# Altium project AMA4B_adapter_board.PrjPcb (part 1 of 2)
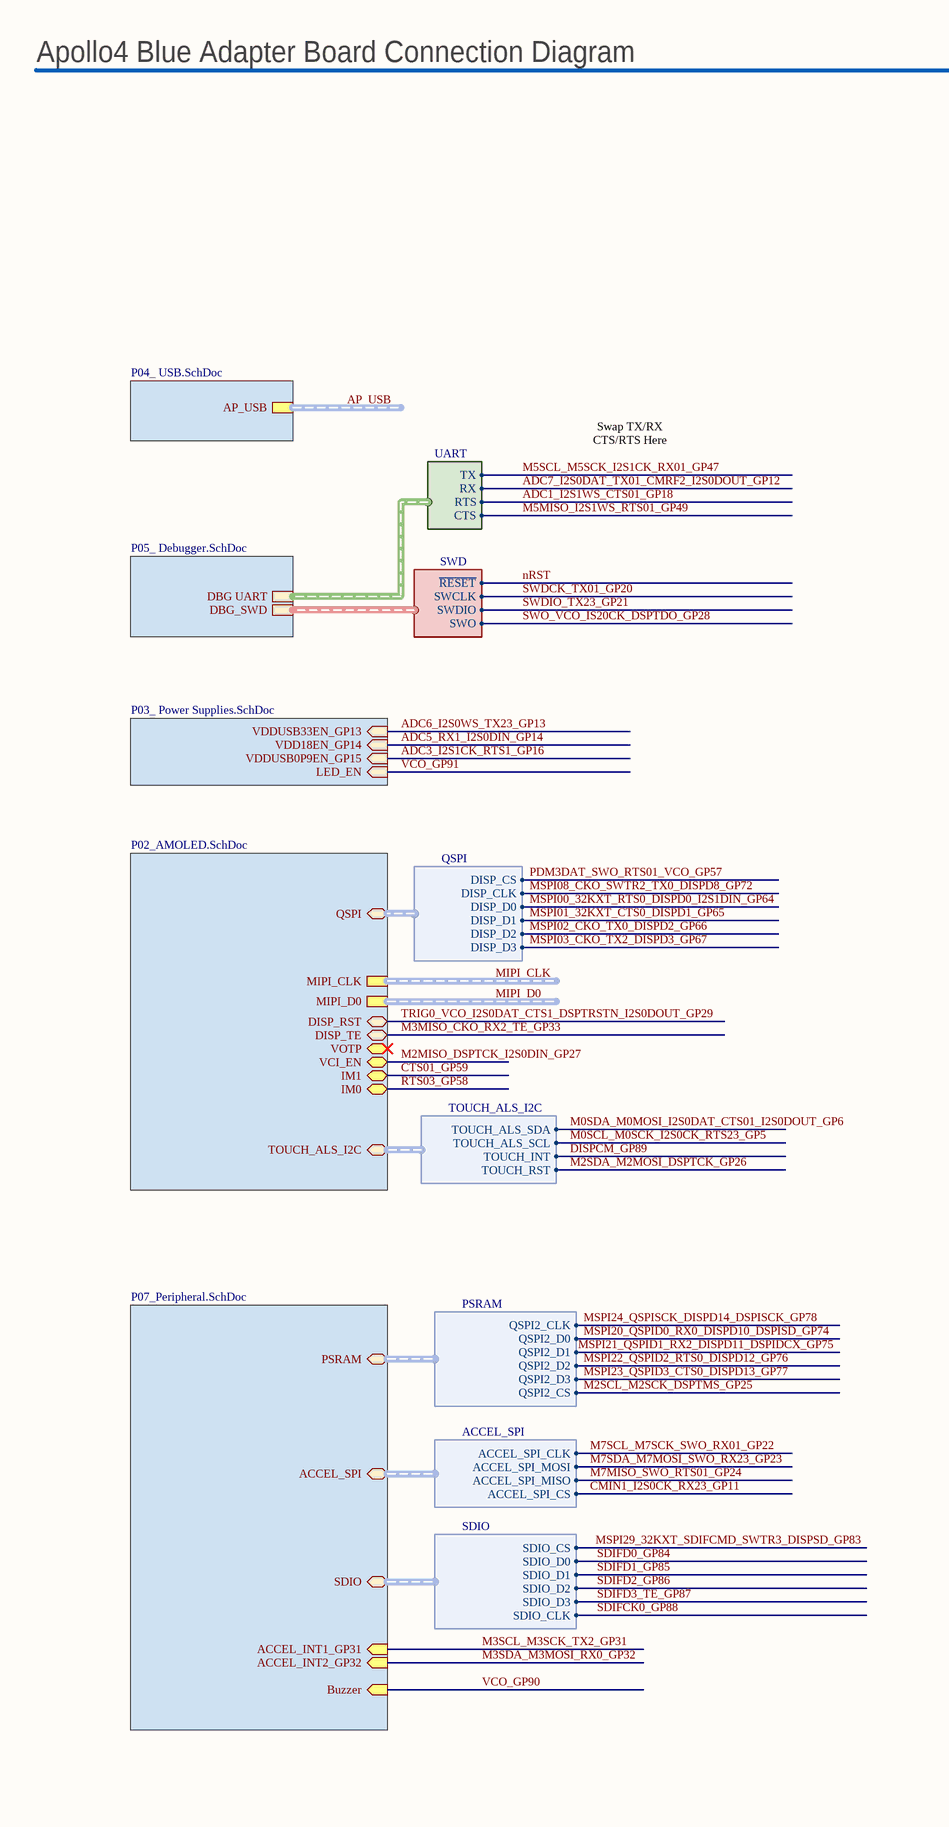
[diagram p0: P01_Top Level.SchDoc, left]
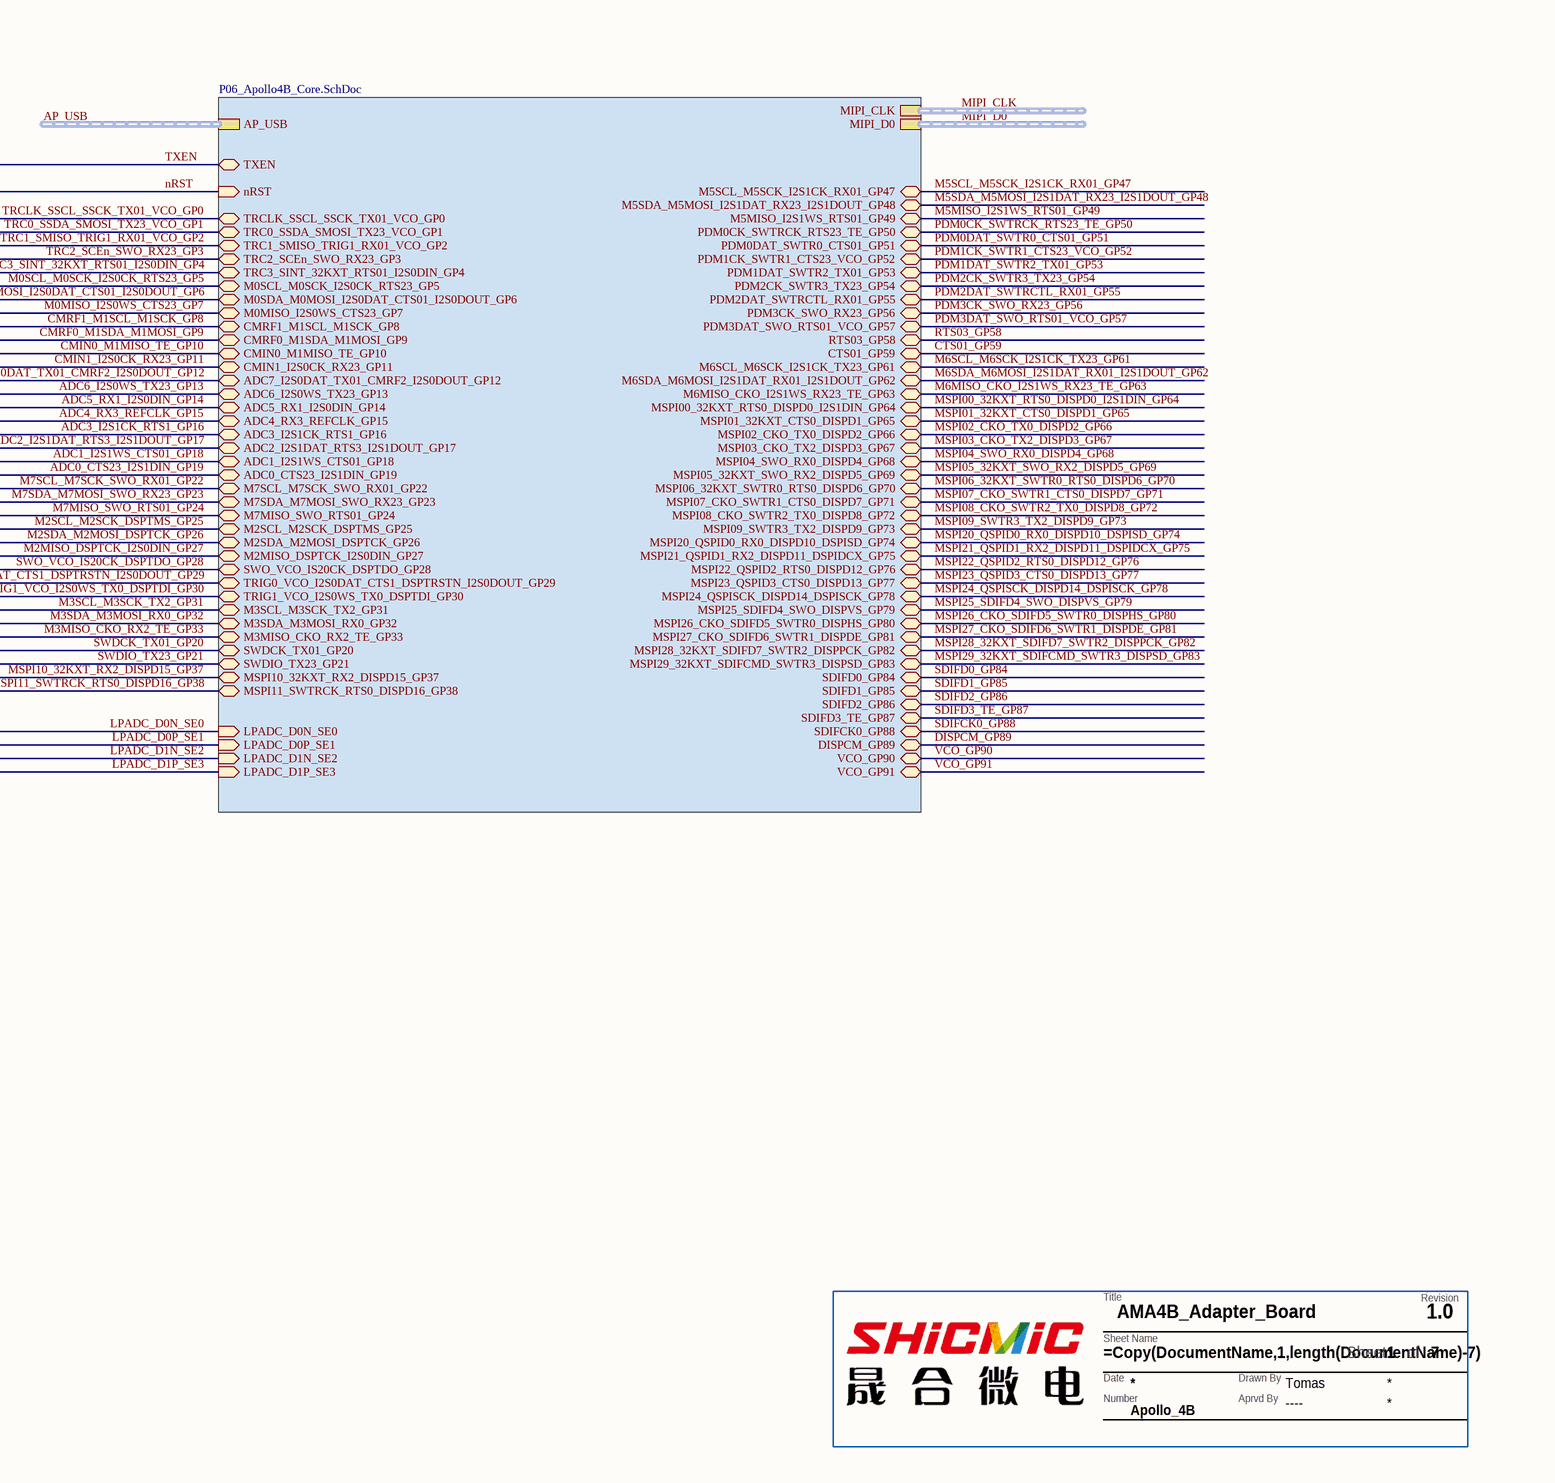
[diagram p1: P01_Top Level.SchDoc, right]
SheetTotal: 7; TBApprovedBy: ----; TBBoardNumber: Apollo_4B; TBDocumentNumber: Apollo_4B; TBDrawnBy: Tomas; TBRevision: 1.0; TBTitle: AMA4B_Adapter_Board
7 sheets, 91 parts. Net scope: hierarchical (ports join the sheet entries above them; power ports are global).
Board file: AMA4B_adapter_board.PcbDoc
Sheets:
  P01_Top Level.SchDoc
    U_P06_ Apollo4B_core = P06_Apollo4B_Core.SchDoc
    U_P03_ Power Supplies = P03_ Power Supplies.SchDoc
    U_P04_ USB = P04_ USB.SchDoc
    U_P05_ Debugger = P05_ Debugger.SchDoc
    U_P02_ AMOLED = P02_AMOLED.SchDoc
    P07_Peripheral = P07_Peripheral.SchDoc

## Sheet P01_Top Level.SchDoc
size C; SheetNumber: 1; SheetTotal: 7

### Parts
(Parts that share a designator on the sheet are numbered #1, #2 ... from top to bottom, then left to right.)
?#1  TitleBlock  (value not drawn)  (graphical)

### Sub-sheets
P07_Peripheral = P07_Peripheral.SchDoc: PSRAM (bidir, harness PSRAM), ACCEL_SPI (bidir, harness ACCEL_SPI), SDIO (bidir, harness SDIO), Buzzer (in), ACCEL_INT1_GP31 (in), ACCEL_INT2_GP32 (in)
U_P02_ AMOLED = P02_AMOLED.SchDoc: QSPI (bidir, harness QSPI), MIPI_CLK (harness MIPI), MIPI_D0 (harness MIPI), DISP_TE (bidir), TOUCH_ALS_I2C (bidir, harness TOUCH_ALS_I2C), DISP_RST (bidir), VOTP (bidir), VCI_EN (bidir), IM1 (bidir), IM0 (bidir)
U_P03_ Power Supplies = P03_ Power Supplies.SchDoc: VDDUSB33EN_GP13 (in), VDD18EN_GP14 (in), LED_EN (in), VDDUSB0P9EN_GP15 (in)
U_P04_ USB = P04_ USB.SchDoc: AP_USB (harness USB)
U_P05_ Debugger = P05_ Debugger.SchDoc: DBG UART (harness UART), DBG_SWD (harness SWD)
U_P06_ Apollo4B_core = P06_Apollo4B_Core.SchDoc: MIPI_CLK (harness MIPI), MIPI_D0 (harness MIPI), TXEN (bidir), nRST (in), AP_USB (harness USB), LPADC_D0P_SE1 (in), LPADC_D0N_SE0 (in), LPADC_D1P_SE3 (in), LPADC_D1N_SE2 (in), TRCLK_SSCL_SSCK_TX01_VCO_GP0 (bidir), TRC0_SSDA_SMOSI_TX23_VCO_GP1 (bidir), TRC1_SMISO_TRIG1_RX01_VCO_GP2 (bidir), TRC2_SCEn_SWO_RX23_GP3 (bidir), M0SCL_M0SCK_I2S0CK_RTS23_GP5 (bidir), M0SDA_M0MOSI_I2S0DAT_CTS01_I2S0DOUT_GP6 (bidir), M0MISO_I2S0WS_CTS23_GP7 (bidir), CMRF1_M1SCL_M1SCK_GP8 (bidir), CMRF0_M1SDA_M1MOSI_GP9 (bidir), CMIN0_M1MISO_TE_GP10 (bidir), CMIN1_I2S0CK_RX23_GP11 (bidir), ADC7_I2S0DAT_TX01_CMRF2_I2S0DOUT_GP12 (bidir), ADC6_I2S0WS_TX23_GP13 (bidir), ADC5_RX1_I2S0DIN_GP14 (bidir), ADC4_RX3_REFCLK_GP15 (bidir), ADC3_I2S1CK_RTS1_GP16 (bidir), ADC2_I2S1DAT_RTS3_I2S1DOUT_GP17 (bidir), ADC1_I2S1WS_CTS01_GP18 (bidir), ADC0_CTS23_I2S1DIN_GP19 (bidir), M7SCL_M7SCK_SWO_RX01_GP22 (bidir), M7SDA_M7MOSI_SWO_RX23_GP23 (bidir), M7MISO_SWO_RTS01_GP24 (bidir), M2SCL_M2SCK_DSPTMS_GP25 (bidir), M2SDA_M2MOSI_DSPTCK_GP26 (bidir), M2MISO_DSPTCK_I2S0DIN_GP27 (bidir), SWO_VCO_IS20CK_DSPTDO_GP28 (bidir), TRIG0_VCO_I2S0DAT_CTS1_DSPTRSTN_I2S0DOUT_GP29 (bidir), TRIG1_VCO_I2S0WS_TX0_DSPTDI_GP30 (bidir), M3SCL_M3SCK_TX2_GP31 (bidir), M3SDA_M3MOSI_RX0_GP32 (bidir), M3MISO_CKO_RX2_TE_GP33 (bidir), SWDCK_TX01_GP20 (bidir), SWDIO_TX23_GP21 (bidir), MSPI10_32KXT_RX2_DISPD15_GP37 (bidir), MSPI11_SWTRCK_RTS0_DISPD16_GP38 (bidir), TRC3_SINT_32KXT_RTS01_I2S0DIN_GP4 (bidir), MSPI27_CKO_SDIFD6_SWTR1_DISPDE_GP81 (bidir), MSPI28_32KXT_SDIFD7_SWTR2_DISPPCK_GP82 (bidir), MSPI29_32KXT_SDIFCMD_SWTR3_DISPSD_GP83 (bidir), SDIFD0_GP84 (bidir), SDIFD1_GP85 (bidir), SDIFD2_GP86 (bidir), SDIFD3_TE_GP87 (bidir), SDIFCK0_GP88 (bidir), VCO_GP91 (bidir), MSPI00_32KXT_RTS0_DISPD0_I2S1DIN_GP64 (bidir), MSPI01_32KXT_CTS0_DISPD1_GP65 (bidir), MSPI02_CKO_TX0_DISPD2_GP66 (bidir), MSPI03_CKO_TX2_DISPD3_GP67 (bidir), MSPI04_SWO_RX0_DISPD4_GP68 (bidir), MSPI05_32KXT_SWO_RX2_DISPD5_GP69 (bidir), MSPI06_32KXT_SWTR0_RTS0_DISPD6_GP70 (bidir), MSPI07_CKO_SWTR1_CTS0_DISPD7_GP71 (bidir), MSPI08_CKO_SWTR2_TX0_DISPD8_GP72 (bidir), MSPI09_SWTR3_TX2_DISPD9_GP73 (bidir), MSPI20_QSPID0_RX0_DISPD10_DSPISD_GP74 (bidir), MSPI21_QSPID1_RX2_DISPD11_DSPIDCX_GP75 (bidir), MSPI22_QSPID2_RTS0_DISPD12_GP76 (bidir), MSPI23_QSPID3_CTS0_DISPD13_GP77 (bidir), MSPI24_QSPISCK_DISPD14_DSPISCK_GP78 (bidir), MSPI25_SDIFD4_SWO_DISPVS_GP79 (bidir), MSPI26_CKO_SDIFD5_SWTR0_DISPHS_GP80 (bidir), M5SCL_M5SCK_I2S1CK_RX01_GP47 (bidir), M5SDA_M5MOSI_I2S1DAT_RX23_I2S1DOUT_GP48 (bidir), M5MISO_I2S1WS_RTS01_GP49 (bidir), PDM0CK_SWTRCK_RTS23_TE_GP50 (bidir), PDM0DAT_SWTR0_CTS01_GP51 (bidir), PDM3CK_SWO_RX23_GP56 (bidir), PDM3DAT_SWO_RTS01_VCO_GP57 (bidir), M6SCL_M6SCK_I2S1CK_TX23_GP61 (bidir), M6SDA_M6MOSI_I2S1DAT_RX01_I2S1DOUT_GP62 (bidir), M6MISO_CKO_I2S1WS_RX23_TE_GP63 (bidir), RTS03_GP58 (bidir), CTS01_GP59 (bidir), PDM1DAT_SWTR2_TX01_GP53 (bidir), PDM1CK_SWTR1_CTS23_VCO_GP52 (bidir), PDM2DAT_SWTRCTL_RX01_GP55 (bidir), PDM2CK_SWTR3_TX23_GP54 (bidir), DISPCM_GP89 (bidir), VCO_GP90 (bidir)

### Harnesses
UART: TX, RX, RTS, CTS
SWD: SWCLK, SWDIO, SWO, ~{RESET}
QSPI: DISP_CLK, DISP_D0, DISP_D1, DISP_D2, DISP_D3, DISP_CS
TOUCH_ALS_I2C: TOUCH_ALS_SDA, TOUCH_ALS_SCL, TOUCH_INT, TOUCH_RST
ACCEL_SPI: ACCEL_SPI_CLK, ACCEL_SPI_MOSI, ACCEL_SPI_MISO, ACCEL_SPI_CS
PSRAM: QSPI2_CLK, QSPI2_D0, QSPI2_D1, QSPI2_D2, QSPI2_D3, QSPI2_CS
SDIO: SDIO_CLK, SDIO_CS, SDIO_D0, SDIO_D1, SDIO_D2, SDIO_D3

### Nets
ADC1_I2S1WS_CTS01_GP18: sheet U_P06_ Apollo4B_core/ADC1_I2S1WS_CTS01_GP18, sheet U_P05_ Debugger/DBG UART.RTS
ADC3_I2S1CK_RTS1_GP16: sheet U_P06_ Apollo4B_core/ADC3_I2S1CK_RTS1_GP16, sheet U_P03_ Power Supplies/VDDUSB0P9EN_GP15
ADC4_RX3_REFCLK_GP15: sheet U_P06_ Apollo4B_core/ADC4_RX3_REFCLK_GP15
ADC5_RX1_I2S0DIN_GP14: sheet U_P06_ Apollo4B_core/ADC5_RX1_I2S0DIN_GP14, sheet U_P03_ Power Supplies/VDD18EN_GP14
ADC6_I2S0WS_TX23_GP13: sheet U_P06_ Apollo4B_core/ADC6_I2S0WS_TX23_GP13, sheet U_P03_ Power Supplies/VDDUSB33EN_GP13
ADC7_I2S0DAT_TX01_CMRF2_I2S0DOUT_GP12: sheet U_P06_ Apollo4B_core/ADC7_I2S0DAT_TX01_CMRF2_I2S0DOUT_GP12, sheet U_P05_ Debugger/DBG UART.RX
CMIN0_M1MISO_TE_GP10: sheet U_P06_ Apollo4B_core/CMIN0_M1MISO_TE_GP10
CMIN1_I2S0CK_RX23_GP11: sheet U_P06_ Apollo4B_core/CMIN1_I2S0CK_RX23_GP11, sheet P07_Peripheral/ACCEL_SPI.ACCEL_SPI_CS
CMRF0_M1SDA_M1MOSI_GP9: sheet U_P06_ Apollo4B_core/CMRF0_M1SDA_M1MOSI_GP9
CMRF1_M1SCL_M1SCK_GP8: sheet U_P06_ Apollo4B_core/CMRF1_M1SCL_M1SCK_GP8
CTS01_GP59: sheet U_P06_ Apollo4B_core/CTS01_GP59, sheet U_P02_ AMOLED/IM1
DISPCM_GP89: sheet U_P06_ Apollo4B_core/DISPCM_GP89, sheet U_P02_ AMOLED/TOUCH_ALS_I2C.TOUCH_INT
M0SCL_M0SCK_I2S0CK_RTS23_GP5: sheet U_P06_ Apollo4B_core/M0SCL_M0SCK_I2S0CK_RTS23_GP5, sheet U_P02_ AMOLED/TOUCH_ALS_I2C.TOUCH_ALS_SCL
M0SDA_M0MOSI_I2S0DAT_CTS01_I2S0DOUT_GP6: sheet U_P06_ Apollo4B_core/M0SDA_M0MOSI_I2S0DAT_CTS01_I2S0DOUT_GP6, sheet U_P02_ AMOLED/TOUCH_ALS_I2C.TOUCH_ALS_SDA
M2MISO_DSPTCK_I2S0DIN_GP27: sheet U_P06_ Apollo4B_core/M2MISO_DSPTCK_I2S0DIN_GP27, sheet U_P02_ AMOLED/VCI_EN
M2SCL_M2SCK_DSPTMS_GP25: sheet U_P06_ Apollo4B_core/M2SCL_M2SCK_DSPTMS_GP25, sheet P07_Peripheral/PSRAM.QSPI2_CS
M2SDA_M2MOSI_DSPTCK_GP26: sheet U_P06_ Apollo4B_core/M2SDA_M2MOSI_DSPTCK_GP26, sheet U_P02_ AMOLED/TOUCH_ALS_I2C.TOUCH_RST
M3MISO_CKO_RX2_TE_GP33: sheet U_P06_ Apollo4B_core/M3MISO_CKO_RX2_TE_GP33, sheet U_P02_ AMOLED/DISP_TE
M3SCL_M3SCK_TX2_GP31: sheet U_P06_ Apollo4B_core/M3SCL_M3SCK_TX2_GP31, sheet P07_Peripheral/ACCEL_INT1_GP31
M3SDA_M3MOSI_RX0_GP32: sheet U_P06_ Apollo4B_core/M3SDA_M3MOSI_RX0_GP32, sheet P07_Peripheral/ACCEL_INT2_GP32
M5MISO_I2S1WS_RTS01_GP49: sheet U_P06_ Apollo4B_core/M5MISO_I2S1WS_RTS01_GP49, sheet U_P05_ Debugger/DBG UART.CTS
M5SCL_M5SCK_I2S1CK_RX01_GP47: sheet U_P06_ Apollo4B_core/M5SCL_M5SCK_I2S1CK_RX01_GP47, sheet U_P05_ Debugger/DBG UART.TX
M7MISO_SWO_RTS01_GP24: sheet U_P06_ Apollo4B_core/M7MISO_SWO_RTS01_GP24, sheet P07_Peripheral/ACCEL_SPI.ACCEL_SPI_MISO
M7SCL_M7SCK_SWO_RX01_GP22: sheet U_P06_ Apollo4B_core/M7SCL_M7SCK_SWO_RX01_GP22, sheet P07_Peripheral/ACCEL_SPI.ACCEL_SPI_CLK
M7SDA_M7MOSI_SWO_RX23_GP23: sheet U_P06_ Apollo4B_core/M7SDA_M7MOSI_SWO_RX23_GP23, sheet P07_Peripheral/ACCEL_SPI.ACCEL_SPI_MOSI
MSPI00_32KXT_RTS0_DISPD0_I2S1DIN_GP64: sheet U_P06_ Apollo4B_core/MSPI00_32KXT_RTS0_DISPD0_I2S1DIN_GP64, sheet U_P02_ AMOLED/QSPI.DISP_D0
MSPI01_32KXT_CTS0_DISPD1_GP65: sheet U_P06_ Apollo4B_core/MSPI01_32KXT_CTS0_DISPD1_GP65, sheet U_P02_ AMOLED/QSPI.DISP_D1
MSPI02_CKO_TX0_DISPD2_GP66: sheet U_P06_ Apollo4B_core/MSPI02_CKO_TX0_DISPD2_GP66, sheet U_P02_ AMOLED/QSPI.DISP_D2
MSPI03_CKO_TX2_DISPD3_GP67: sheet U_P06_ Apollo4B_core/MSPI03_CKO_TX2_DISPD3_GP67, sheet U_P02_ AMOLED/QSPI.DISP_D3
MSPI08_CKO_SWTR2_TX0_DISPD8_GP72: sheet U_P06_ Apollo4B_core/MSPI08_CKO_SWTR2_TX0_DISPD8_GP72, sheet U_P02_ AMOLED/QSPI.DISP_CLK
MSPI20_QSPID0_RX0_DISPD10_DSPISD_GP74: sheet U_P06_ Apollo4B_core/MSPI20_QSPID0_RX0_DISPD10_DSPISD_GP74, sheet P07_Peripheral/PSRAM.QSPI2_D0
MSPI21_QSPID1_RX2_DISPD11_DSPIDCX_GP75: sheet U_P06_ Apollo4B_core/MSPI21_QSPID1_RX2_DISPD11_DSPIDCX_GP75, sheet P07_Peripheral/PSRAM.QSPI2_D1
MSPI22_QSPID2_RTS0_DISPD12_GP76: sheet U_P06_ Apollo4B_core/MSPI22_QSPID2_RTS0_DISPD12_GP76, sheet P07_Peripheral/PSRAM.QSPI2_D2
MSPI23_QSPID3_CTS0_DISPD13_GP77: sheet U_P06_ Apollo4B_core/MSPI23_QSPID3_CTS0_DISPD13_GP77, sheet P07_Peripheral/PSRAM.QSPI2_D3
MSPI24_QSPISCK_DISPD14_DSPISCK_GP78: sheet U_P06_ Apollo4B_core/MSPI24_QSPISCK_DISPD14_DSPISCK_GP78, sheet P07_Peripheral/PSRAM.QSPI2_CLK
MSPI29_32KXT_SDIFCMD_SWTR3_DISPSD_GP83: sheet U_P06_ Apollo4B_core/MSPI29_32KXT_SDIFCMD_SWTR3_DISPSD_GP83, sheet P07_Peripheral/SDIO.SDIO_CS
nRST: sheet U_P06_ Apollo4B_core/nRST, sheet U_P05_ Debugger/DBG_SWD.~{RESET}
PDM3DAT_SWO_RTS01_VCO_GP57: sheet U_P06_ Apollo4B_core/PDM3DAT_SWO_RTS01_VCO_GP57, sheet U_P02_ AMOLED/QSPI.DISP_CS
RTS03_GP58: sheet U_P06_ Apollo4B_core/RTS03_GP58, sheet U_P02_ AMOLED/IM0
SDIFCK0_GP88: sheet U_P06_ Apollo4B_core/SDIFCK0_GP88, sheet P07_Peripheral/SDIO.SDIO_CLK
SDIFD0_GP84: sheet U_P06_ Apollo4B_core/SDIFD0_GP84, sheet P07_Peripheral/SDIO.SDIO_D0
SDIFD1_GP85: sheet U_P06_ Apollo4B_core/SDIFD1_GP85, sheet P07_Peripheral/SDIO.SDIO_D1
SDIFD2_GP86: sheet U_P06_ Apollo4B_core/SDIFD2_GP86, sheet P07_Peripheral/SDIO.SDIO_D2
SDIFD3_TE_GP87: sheet U_P06_ Apollo4B_core/SDIFD3_TE_GP87, sheet P07_Peripheral/SDIO.SDIO_D3
SWDCK_TX01_GP20: sheet U_P06_ Apollo4B_core/SWDCK_TX01_GP20, sheet U_P05_ Debugger/DBG_SWD.SWCLK
SWDIO_TX23_GP21: sheet U_P06_ Apollo4B_core/SWDIO_TX23_GP21, sheet U_P05_ Debugger/DBG_SWD.SWDIO
SWO_VCO_IS20CK_DSPTDO_GP28: sheet U_P06_ Apollo4B_core/SWO_VCO_IS20CK_DSPTDO_GP28, sheet U_P05_ Debugger/DBG_SWD.SWO
TRIG0_VCO_I2S0DAT_CTS1_DSPTRSTN_I2S0DOUT_GP29: sheet U_P06_ Apollo4B_core/TRIG0_VCO_I2S0DAT_CTS1_DSPTRSTN_I2S0DOUT_GP29, sheet U_P02_ AMOLED/DISP_RST
VCO_GP90: sheet U_P06_ Apollo4B_core/VCO_GP90, sheet P07_Peripheral/Buzzer
VCO_GP91: sheet U_P06_ Apollo4B_core/VCO_GP91, sheet U_P03_ Power Supplies/LED_EN

### Buses and harness runs
harness AP_USB = sheet U_P04_ USB/AP_USB
harness AP_USB = sheet U_P06_ Apollo4B_core/AP_USB
harness MIPI_CLK = sheet U_P02_ AMOLED/MIPI_CLK
harness MIPI_CLK = sheet U_P06_ Apollo4B_core/MIPI_CLK
harness MIPI_D0 = sheet U_P02_ AMOLED/MIPI_D0
harness MIPI_D0 = sheet U_P06_ Apollo4B_core/MIPI_D0

### Notes on the sheet
- Apollo4 Blue Adapter Board Connection Diagram
- Swap TX/RX
- CTS/RTS Here

### Library data of the parts
?#1 = TitleBlock: Title block for Ambiq Schematics. Please have the following parameters entered in Project>Project Options>Parameters: / TBTitle / TBDocumentNumber / TBRevision / TBDrawnBy / TBApprovedBy; AMBIQ PN: TitleBlock

## Sheet P06_Apollo4B_Core.SchDoc
size A4; SheetNumber: 6; SheetTotal: 7
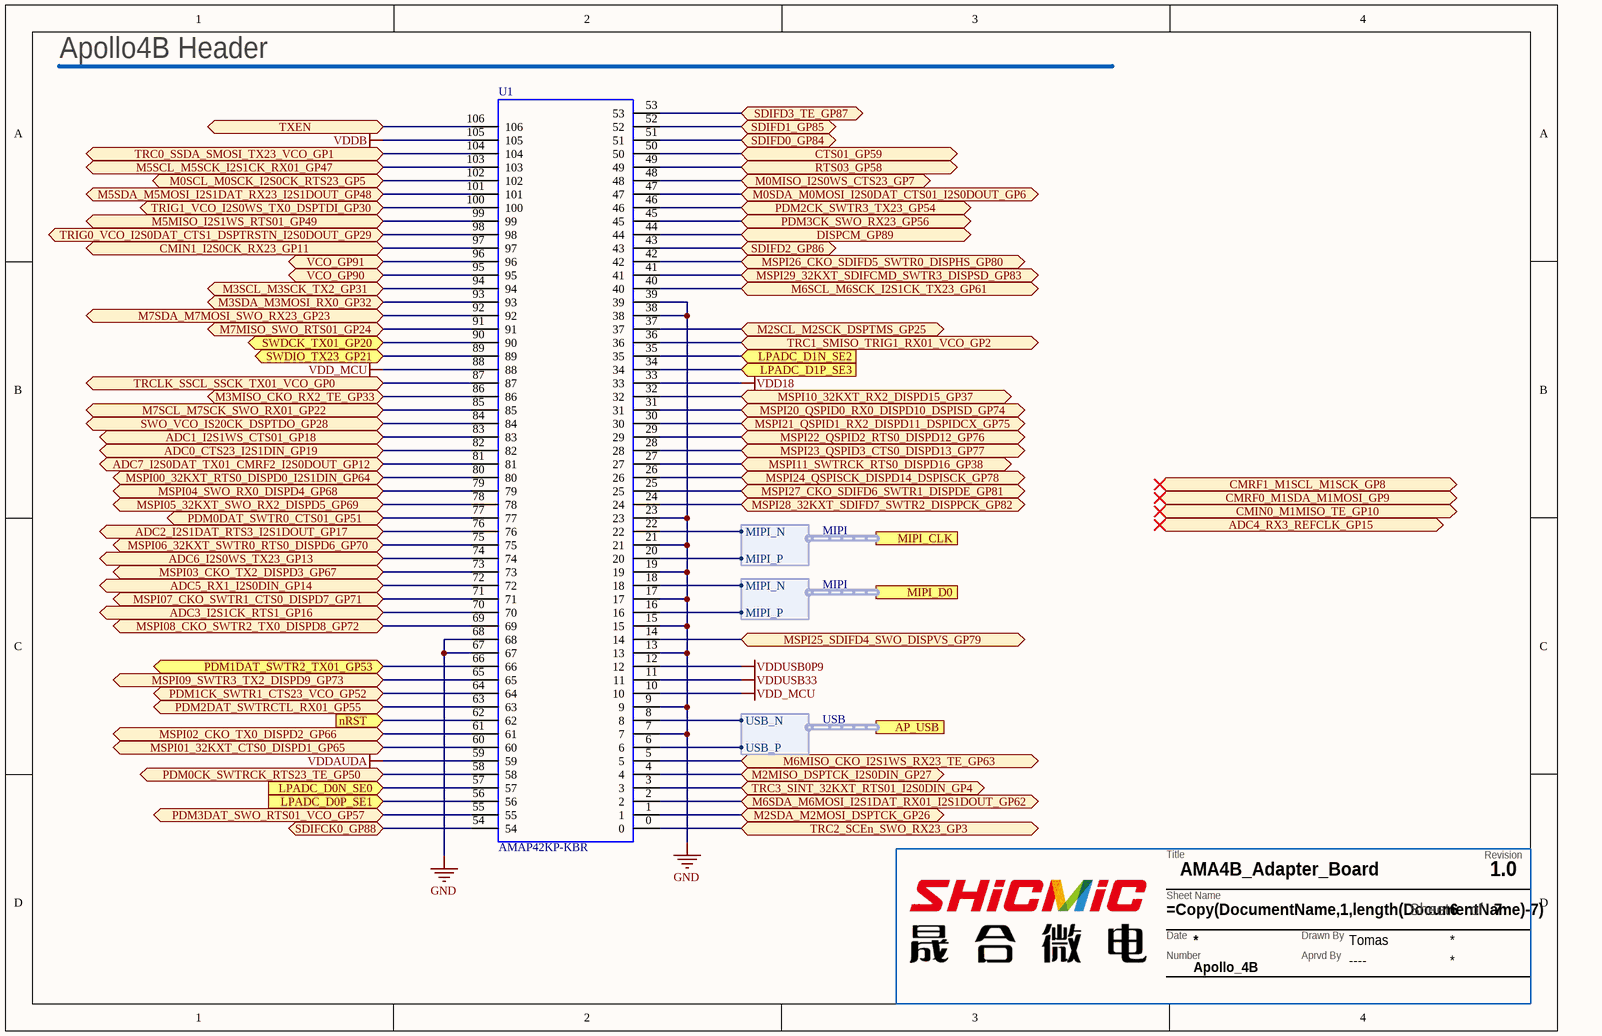
[diagram p2: P06_Apollo4B_Core.SchDoc]

### Parts
(Parts that share a designator on the sheet are numbered #1, #2 ... from top to bottom, then left to right.)
?#2  TitleBlock  (value not drawn)  (graphical)
U1  AMAP42KP-KBR  [Apollo_4B]

### Ports
ADC0_CTS23_I2S1DIN_GP19 (bidir), ADC1_I2S1WS_CTS01_GP18 (bidir), ADC2_I2S1DAT_RTS3_I2S1DOUT_GP17 (bidir), ADC3_I2S1CK_RTS1_GP16 (bidir), ADC4_RX3_REFCLK_GP15 (bidir), ADC5_RX1_I2S0DIN_GP14 (bidir), ADC6_I2S0WS_TX23_GP13 (bidir), ADC7_I2S0DAT_TX01_CMRF2_I2S0DOUT_GP12 (bidir), AP_USB (harness USB), CMIN0_M1MISO_TE_GP10 (bidir), CMIN1_I2S0CK_RX23_GP11 (bidir), CMRF0_M1SDA_M1MOSI_GP9 (bidir), CMRF1_M1SCL_M1SCK_GP8 (bidir), CTS01_GP59 (bidir), DISPCM_GP89 (bidir), LPADC_D0N_SE0 (in), LPADC_D0P_SE1 (in), LPADC_D1N_SE2 (in), LPADC_D1P_SE3 (in), M0MISO_I2S0WS_CTS23_GP7 (bidir), M0SCL_M0SCK_I2S0CK_RTS23_GP5 (bidir), M0SDA_M0MOSI_I2S0DAT_CTS01_I2S0DOUT_GP6 (bidir), M2MISO_DSPTCK_I2S0DIN_GP27 (bidir), M2SCL_M2SCK_DSPTMS_GP25 (bidir), M2SDA_M2MOSI_DSPTCK_GP26 (bidir), M3MISO_CKO_RX2_TE_GP33 (bidir), M3SCL_M3SCK_TX2_GP31 (bidir), M3SDA_M3MOSI_RX0_GP32 (bidir), M5MISO_I2S1WS_RTS01_GP49 (bidir), M5SCL_M5SCK_I2S1CK_RX01_GP47 (bidir), M5SDA_M5MOSI_I2S1DAT_RX23_I2S1DOUT_GP48 (bidir), M6MISO_CKO_I2S1WS_RX23_TE_GP63 (bidir), M6SCL_M6SCK_I2S1CK_TX23_GP61 (bidir), M6SDA_M6MOSI_I2S1DAT_RX01_I2S1DOUT_GP62 (bidir), M7MISO_SWO_RTS01_GP24 (bidir), M7SCL_M7SCK_SWO_RX01_GP22 (bidir), M7SDA_M7MOSI_SWO_RX23_GP23 (bidir), MIPI_CLK (harness MIPI), MIPI_D0 (harness MIPI), MSPI00_32KXT_RTS0_DISPD0_I2S1DIN_GP64 (bidir), MSPI01_32KXT_CTS0_DISPD1_GP65 (bidir), MSPI02_CKO_TX0_DISPD2_GP66 (bidir), MSPI03_CKO_TX2_DISPD3_GP67 (bidir), MSPI04_SWO_RX0_DISPD4_GP68 (bidir), MSPI05_32KXT_SWO_RX2_DISPD5_GP69 (bidir), MSPI06_32KXT_SWTR0_RTS0_DISPD6_GP70 (bidir), MSPI07_CKO_SWTR1_CTS0_DISPD7_GP71 (bidir), MSPI08_CKO_SWTR2_TX0_DISPD8_GP72 (bidir), MSPI09_SWTR3_TX2_DISPD9_GP73 (bidir), MSPI10_32KXT_RX2_DISPD15_GP37 (bidir), MSPI11_SWTRCK_RTS0_DISPD16_GP38 (bidir), MSPI20_QSPID0_RX0_DISPD10_DSPISD_GP74 (bidir), MSPI21_QSPID1_RX2_DISPD11_DSPIDCX_GP75 (bidir), MSPI22_QSPID2_RTS0_DISPD12_GP76 (bidir), MSPI23_QSPID3_CTS0_DISPD13_GP77 (bidir), MSPI24_QSPISCK_DISPD14_DSPISCK_GP78 (bidir), MSPI25_SDIFD4_SWO_DISPVS_GP79 (bidir), MSPI26_CKO_SDIFD5_SWTR0_DISPHS_GP80 (bidir), MSPI27_CKO_SDIFD6_SWTR1_DISPDE_GP81 (bidir), MSPI28_32KXT_SDIFD7_SWTR2_DISPPCK_GP82 (bidir), MSPI29_32KXT_SDIFCMD_SWTR3_DISPSD_GP83 (bidir), nRST (in), PDM0CK_SWTRCK_RTS23_TE_GP50 (bidir), PDM0DAT_SWTR0_CTS01_GP51 (bidir), PDM1CK_SWTR1_CTS23_VCO_GP52 (bidir), PDM1DAT_SWTR2_TX01_GP53 (bidir), PDM2CK_SWTR3_TX23_GP54 (bidir), PDM2DAT_SWTRCTL_RX01_GP55 (bidir), PDM3CK_SWO_RX23_GP56 (bidir), PDM3DAT_SWO_RTS01_VCO_GP57 (bidir), RTS03_GP58 (bidir), SDIFCK0_GP88 (bidir), SDIFD0_GP84 (bidir), SDIFD1_GP85 (bidir), SDIFD2_GP86 (bidir), SDIFD3_TE_GP87 (bidir), SWDCK_TX01_GP20 (bidir), SWDIO_TX23_GP21 (bidir), SWO_VCO_IS20CK_DSPTDO_GP28 (bidir), TRC0_SSDA_SMOSI_TX23_VCO_GP1 (bidir), TRC1_SMISO_TRIG1_RX01_VCO_GP2 (bidir), TRC2_SCEn_SWO_RX23_GP3 (bidir), TRC3_SINT_32KXT_RTS01_I2S0DIN_GP4 (bidir), TRCLK_SSCL_SSCK_TX01_VCO_GP0 (bidir), TRIG0_VCO_I2S0DAT_CTS1_DSPTRSTN_I2S0DOUT_GP29 (bidir), TRIG1_VCO_I2S0WS_TX0_DSPTDI_GP30 (bidir), TXEN (bidir), VCO_GP90 (bidir), VCO_GP91 (bidir)

### Harnesses
USB: USB_N, USB_P
MIPI: MIPI_N, MIPI_P

### Nets
GND: U1.7 U1.9 U1.13 U1.15 U1.17 U1.19 U1.21 U1.23 U1.38 U1.39 U1.67 U1.68
VDD18: U1.33
VDD_MCU: U1.10 U1.59 U1.88 U1.105  [also labelled VDDAUDA, VDDB]  [project net VDD_1.8V]
VDDUSB0P9: U1.12
VDDUSB33: U1.11
ADC0_CTS23_I2S1DIN_GP19: U1.82 ; port ADC0_CTS23_I2S1DIN_GP19
ADC1_I2S1WS_CTS01_GP18: U1.83 ; port ADC1_I2S1WS_CTS01_GP18
ADC2_I2S1DAT_RTS3_I2S1DOUT_GP17: U1.76 ; port ADC2_I2S1DAT_RTS3_I2S1DOUT_GP17
ADC3_I2S1CK_RTS1_GP16: U1.70 ; port ADC3_I2S1CK_RTS1_GP16
ADC5_RX1_I2S0DIN_GP14: U1.72 ; port ADC5_RX1_I2S0DIN_GP14
ADC6_I2S0WS_TX23_GP13: U1.74 ; port ADC6_I2S0WS_TX23_GP13
ADC7_I2S0DAT_TX01_CMRF2_I2S0DOUT_GP12: U1.81 ; port ADC7_I2S0DAT_TX01_CMRF2_I2S0DOUT_GP12
AP_USB.USB_N: U1.8 ; port AP_USB.USB_N
AP_USB.USB_P: U1.6 ; port AP_USB.USB_P
CMIN1_I2S0CK_RX23_GP11: U1.97 ; port CMIN1_I2S0CK_RX23_GP11
CTS01_GP59: U1.50 ; port CTS01_GP59
DISPCM_GP89: U1.44 ; port DISPCM_GP89
LPADC_D0N_SE0: U1.57 ; port LPADC_D0N_SE0
LPADC_D0P_SE1: U1.56 ; port LPADC_D0P_SE1
LPADC_D1N_SE2: U1.35 ; port LPADC_D1N_SE2
LPADC_D1P_SE3: U1.34 ; port LPADC_D1P_SE3
M0MISO_I2S0WS_CTS23_GP7: U1.48 ; port M0MISO_I2S0WS_CTS23_GP7
M0SCL_M0SCK_I2S0CK_RTS23_GP5: U1.102 ; port M0SCL_M0SCK_I2S0CK_RTS23_GP5
M0SDA_M0MOSI_I2S0DAT_CTS01_I2S0DOUT_GP6: U1.47 ; port M0SDA_M0MOSI_I2S0DAT_CTS01_I2S0DOUT_GP6
M2MISO_DSPTCK_I2S0DIN_GP27: U1.4 ; port M2MISO_DSPTCK_I2S0DIN_GP27
M2SCL_M2SCK_DSPTMS_GP25: U1.37 ; port M2SCL_M2SCK_DSPTMS_GP25
M2SDA_M2MOSI_DSPTCK_GP26: U1.1 ; port M2SDA_M2MOSI_DSPTCK_GP26
M3MISO_CKO_RX2_TE_GP33: U1.86 ; port M3MISO_CKO_RX2_TE_GP33
M3SCL_M3SCK_TX2_GP31: U1.94 ; port M3SCL_M3SCK_TX2_GP31
M3SDA_M3MOSI_RX0_GP32: U1.93 ; port M3SDA_M3MOSI_RX0_GP32
M5MISO_I2S1WS_RTS01_GP49: U1.99 ; port M5MISO_I2S1WS_RTS01_GP49
M5SCL_M5SCK_I2S1CK_RX01_GP47: U1.103 ; port M5SCL_M5SCK_I2S1CK_RX01_GP47
M5SDA_M5MOSI_I2S1DAT_RX23_I2S1DOUT_GP48: U1.101 ; port M5SDA_M5MOSI_I2S1DAT_RX23_I2S1DOUT_GP48
M6MISO_CKO_I2S1WS_RX23_TE_GP63: U1.5 ; port M6MISO_CKO_I2S1WS_RX23_TE_GP63
M6SCL_M6SCK_I2S1CK_TX23_GP61: U1.40 ; port M6SCL_M6SCK_I2S1CK_TX23_GP61
M6SDA_M6MOSI_I2S1DAT_RX01_I2S1DOUT_GP62: U1.2 ; port M6SDA_M6MOSI_I2S1DAT_RX01_I2S1DOUT_GP62
M7MISO_SWO_RTS01_GP24: U1.91 ; port M7MISO_SWO_RTS01_GP24
M7SCL_M7SCK_SWO_RX01_GP22: U1.85 ; port M7SCL_M7SCK_SWO_RX01_GP22
M7SDA_M7MOSI_SWO_RX23_GP23: U1.92 ; port M7SDA_M7MOSI_SWO_RX23_GP23
MIPI_CLK.MIPI_N: U1.22 ; port MIPI_CLK.MIPI_N
MIPI_CLK.MIPI_P: U1.20 ; port MIPI_CLK.MIPI_P
MIPI_D0.MIPI_N: U1.18 ; port MIPI_D0.MIPI_N
MIPI_D0.MIPI_P: U1.16 ; port MIPI_D0.MIPI_P
MSPI00_32KXT_RTS0_DISPD0_I2S1DIN_GP64: U1.80 ; port MSPI00_32KXT_RTS0_DISPD0_I2S1DIN_GP64
MSPI01_32KXT_CTS0_DISPD1_GP65: U1.60 ; port MSPI01_32KXT_CTS0_DISPD1_GP65
MSPI02_CKO_TX0_DISPD2_GP66: U1.61 ; port MSPI02_CKO_TX0_DISPD2_GP66
MSPI03_CKO_TX2_DISPD3_GP67: U1.73 ; port MSPI03_CKO_TX2_DISPD3_GP67
MSPI04_SWO_RX0_DISPD4_GP68: U1.79 ; port MSPI04_SWO_RX0_DISPD4_GP68
MSPI05_32KXT_SWO_RX2_DISPD5_GP69: U1.78 ; port MSPI05_32KXT_SWO_RX2_DISPD5_GP69
MSPI06_32KXT_SWTR0_RTS0_DISPD6_GP70: U1.75 ; port MSPI06_32KXT_SWTR0_RTS0_DISPD6_GP70
MSPI07_CKO_SWTR1_CTS0_DISPD7_GP71: U1.71 ; port MSPI07_CKO_SWTR1_CTS0_DISPD7_GP71
MSPI08_CKO_SWTR2_TX0_DISPD8_GP72: U1.69 ; port MSPI08_CKO_SWTR2_TX0_DISPD8_GP72
MSPI09_SWTR3_TX2_DISPD9_GP73: U1.65 ; port MSPI09_SWTR3_TX2_DISPD9_GP73
MSPI10_32KXT_RX2_DISPD15_GP37: U1.32 ; port MSPI10_32KXT_RX2_DISPD15_GP37
MSPI11_SWTRCK_RTS0_DISPD16_GP38: U1.27 ; port MSPI11_SWTRCK_RTS0_DISPD16_GP38
MSPI20_QSPID0_RX0_DISPD10_DSPISD_GP74: U1.31 ; port MSPI20_QSPID0_RX0_DISPD10_DSPISD_GP74
MSPI21_QSPID1_RX2_DISPD11_DSPIDCX_GP75: U1.30 ; port MSPI21_QSPID1_RX2_DISPD11_DSPIDCX_GP75
MSPI22_QSPID2_RTS0_DISPD12_GP76: U1.29 ; port MSPI22_QSPID2_RTS0_DISPD12_GP76
MSPI23_QSPID3_CTS0_DISPD13_GP77: U1.28 ; port MSPI23_QSPID3_CTS0_DISPD13_GP77
MSPI24_QSPISCK_DISPD14_DSPISCK_GP78: U1.26 ; port MSPI24_QSPISCK_DISPD14_DSPISCK_GP78
MSPI25_SDIFD4_SWO_DISPVS_GP79: U1.14 ; port MSPI25_SDIFD4_SWO_DISPVS_GP79
MSPI26_CKO_SDIFD5_SWTR0_DISPHS_GP80: U1.42 ; port MSPI26_CKO_SDIFD5_SWTR0_DISPHS_GP80
MSPI27_CKO_SDIFD6_SWTR1_DISPDE_GP81: U1.25 ; port MSPI27_CKO_SDIFD6_SWTR1_DISPDE_GP81
MSPI28_32KXT_SDIFD7_SWTR2_DISPPCK_GP82: U1.24 ; port MSPI28_32KXT_SDIFD7_SWTR2_DISPPCK_GP82
MSPI29_32KXT_SDIFCMD_SWTR3_DISPSD_GP83: U1.41 ; port MSPI29_32KXT_SDIFCMD_SWTR3_DISPSD_GP83
nRST: U1.62 ; port nRST
PDM0CK_SWTRCK_RTS23_TE_GP50: U1.58 ; port PDM0CK_SWTRCK_RTS23_TE_GP50
PDM0DAT_SWTR0_CTS01_GP51: U1.77 ; port PDM0DAT_SWTR0_CTS01_GP51
PDM1CK_SWTR1_CTS23_VCO_GP52: U1.64 ; port PDM1CK_SWTR1_CTS23_VCO_GP52
PDM1DAT_SWTR2_TX01_GP53: U1.66 ; port PDM1DAT_SWTR2_TX01_GP53
PDM2CK_SWTR3_TX23_GP54: U1.46 ; port PDM2CK_SWTR3_TX23_GP54
PDM2DAT_SWTRCTL_RX01_GP55: U1.63 ; port PDM2DAT_SWTRCTL_RX01_GP55
PDM3CK_SWO_RX23_GP56: U1.45 ; port PDM3CK_SWO_RX23_GP56
PDM3DAT_SWO_RTS01_VCO_GP57: U1.55 ; port PDM3DAT_SWO_RTS01_VCO_GP57
RTS03_GP58: U1.49 ; port RTS03_GP58
SDIFCK0_GP88: U1.54 ; port SDIFCK0_GP88
SDIFD0_GP84: U1.51 ; port SDIFD0_GP84
SDIFD1_GP85: U1.52 ; port SDIFD1_GP85
SDIFD2_GP86: U1.43 ; port SDIFD2_GP86
SDIFD3_TE_GP87: U1.53 ; port SDIFD3_TE_GP87
SWDCK_TX01_GP20: U1.90 ; port SWDCK_TX01_GP20
SWDIO_TX23_GP21: U1.89 ; port SWDIO_TX23_GP21
SWO_VCO_IS20CK_DSPTDO_GP28: U1.84 ; port SWO_VCO_IS20CK_DSPTDO_GP28
TRC0_SSDA_SMOSI_TX23_VCO_GP1: U1.104 ; port TRC0_SSDA_SMOSI_TX23_VCO_GP1
TRC1_SMISO_TRIG1_RX01_VCO_GP2: U1.36 ; port TRC1_SMISO_TRIG1_RX01_VCO_GP2
TRC2_SCEn_SWO_RX23_GP3: U1.0 ; port TRC2_SCEn_SWO_RX23_GP3
TRC3_SINT_32KXT_RTS01_I2S0DIN_GP4: U1.3 ; port TRC3_SINT_32KXT_RTS01_I2S0DIN_GP4
TRCLK_SSCL_SSCK_TX01_VCO_GP0: U1.87 ; port TRCLK_SSCL_SSCK_TX01_VCO_GP0
TRIG0_VCO_I2S0DAT_CTS1_DSPTRSTN_I2S0DOUT_GP29: U1.98 ; port TRIG0_VCO_I2S0DAT_CTS1_DSPTRSTN_I2S0DOUT_GP29
TRIG1_VCO_I2S0WS_TX0_DSPTDI_GP30: U1.100 ; port TRIG1_VCO_I2S0WS_TX0_DSPTDI_GP30
TXEN: U1.106 ; port TXEN
VCO_GP90: U1.95 ; port VCO_GP90
VCO_GP91: U1.96 ; port VCO_GP91

### Notes on the sheet
- Apollo4B Header
- (in symbol TitleBlock) Revision; Title; Sheet Name; Sheet; of; Date; Drawn By; Number; Aprvd By

### Library data of the parts
?#2 = TitleBlock: as ?#1 on sheet P01_Top Level; AMBIQ PN: TitleBlock
U1 = APOLLO4B_OUT: None; AMBIQ PN: APOLLO4P; Category: Microcontrollers

## Sheet P03_ Power Supplies.SchDoc
size A3; SheetNumber: 3; SheetTotal: 7
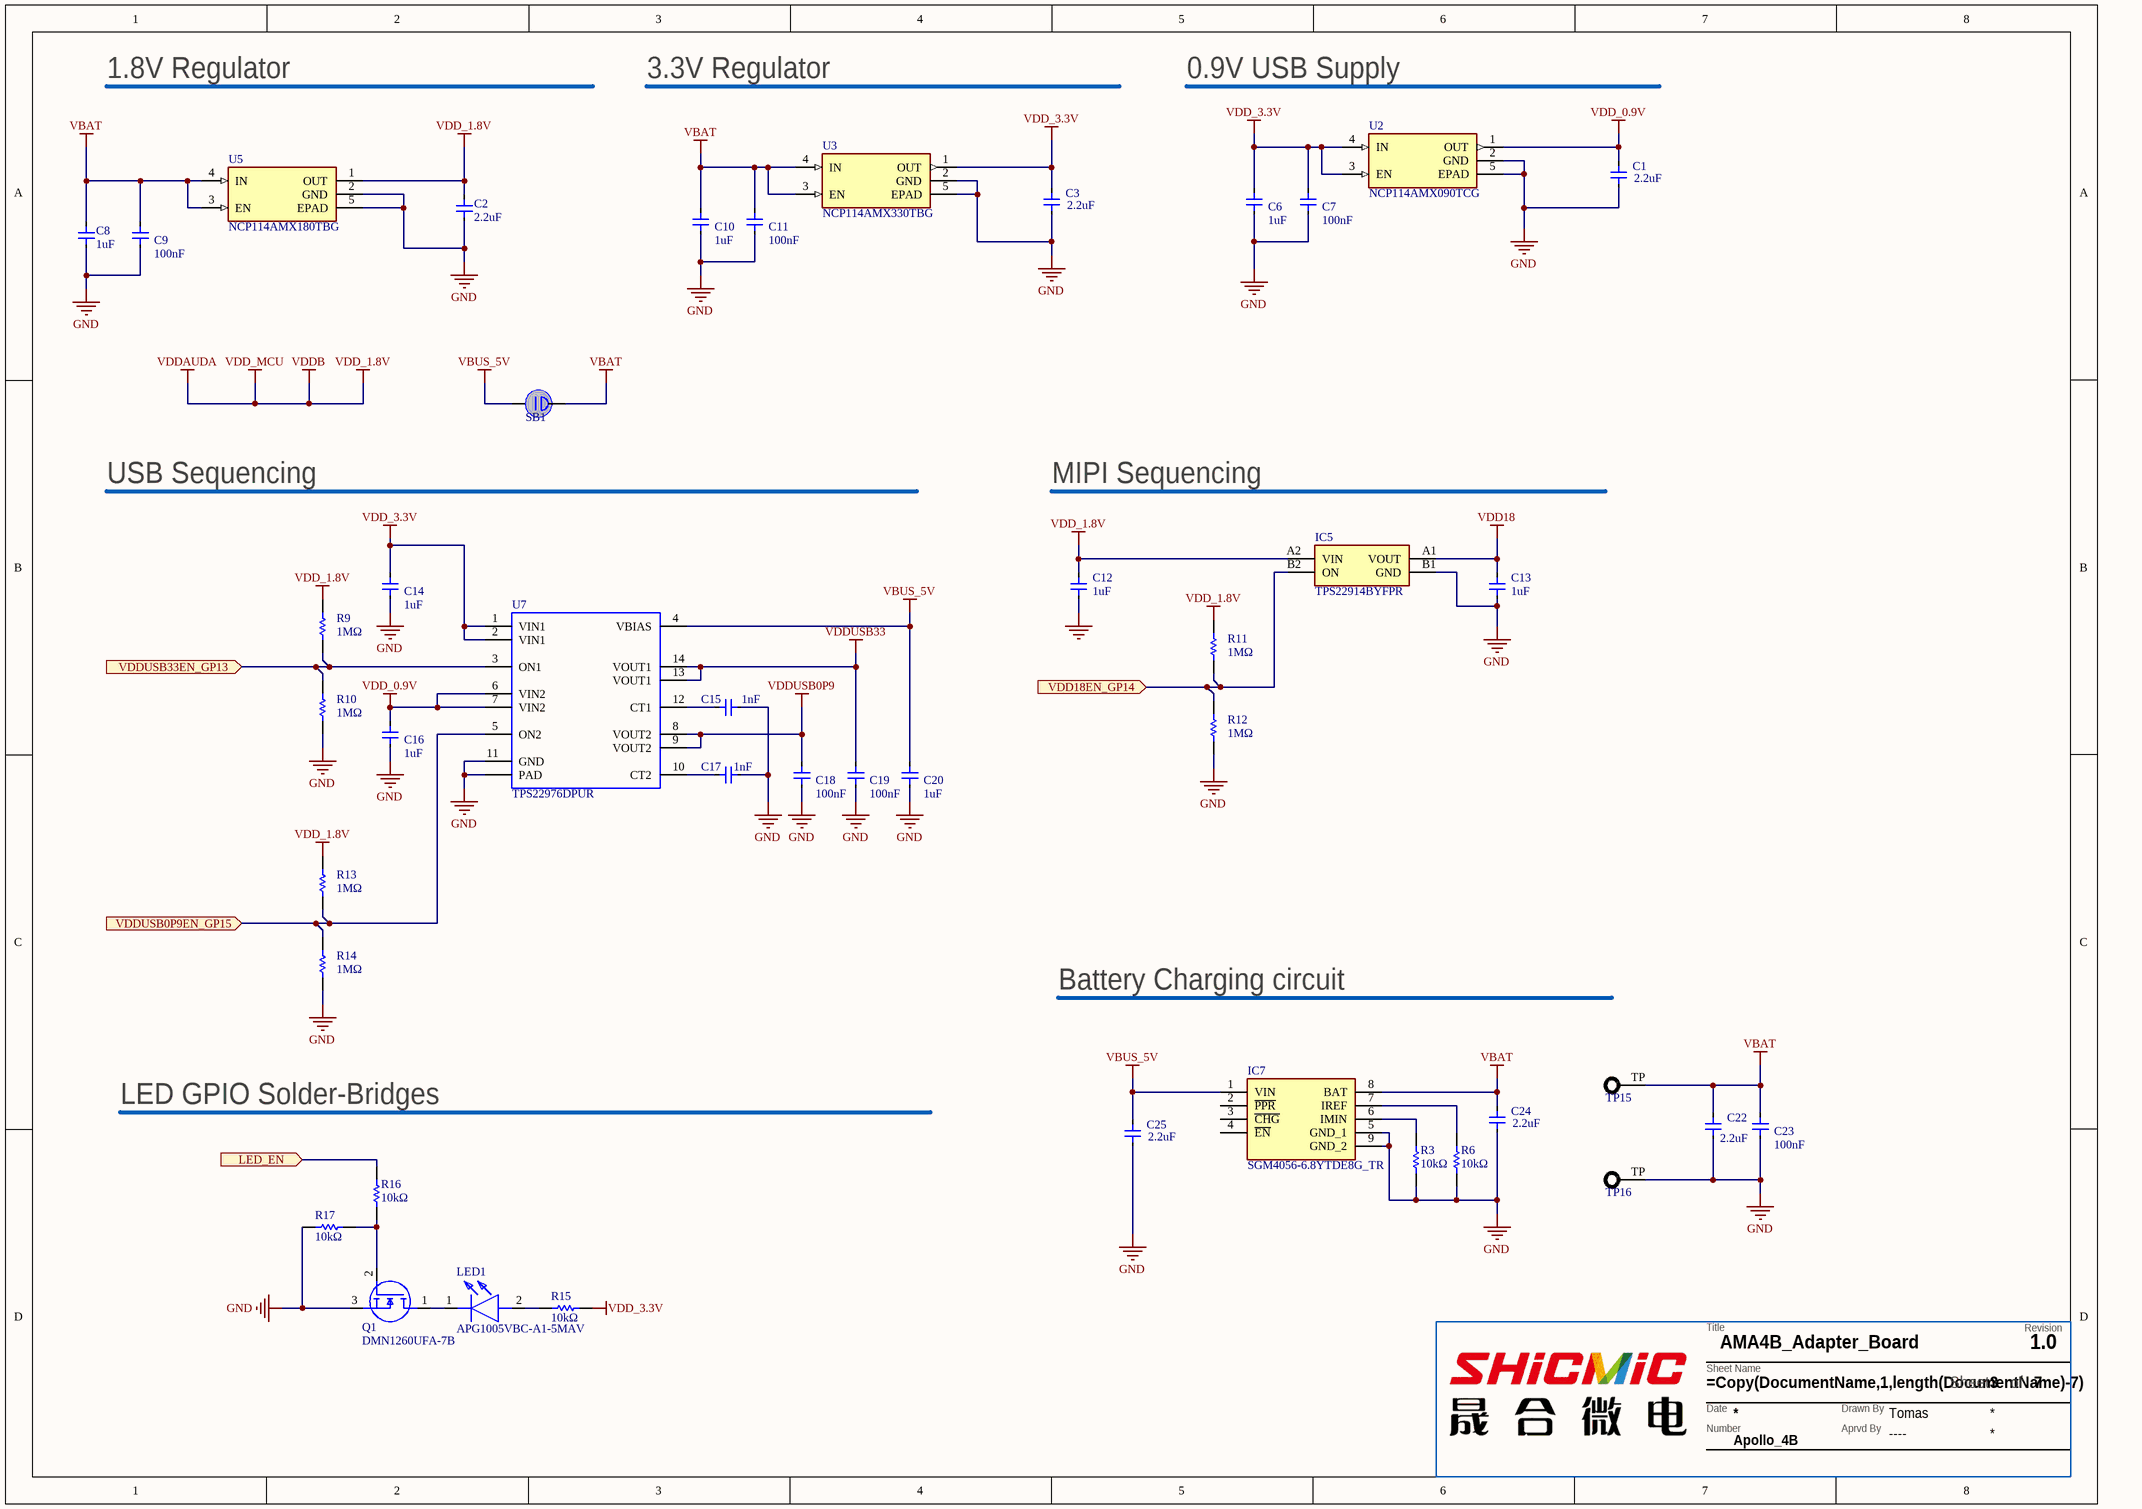
[diagram p3: P03_ Power Supplies.SchDoc]

### Parts
(Parts that share a designator on the sheet are numbered #1, #2 ... from top to bottom, then left to right.)
?#3  TitleBlock  (value not drawn)  (graphical)
C1  2.2uF  [CAP_0402]
C2  2.2uF  [CAP_0402]
C3  2.2uF  [CAP_0402]
C6  1uF  [CAP_0402]
C7  100nF  [CAP_0402]
C8  1uF  [CAP_0402]
C9  100nF  [CAP_0402]
C10  1uF  [CAP_0402]
C11  100nF  [CAP_0402]
C12  1uF  [CAP_0402]
C13  1uF  [CAP_0402]
C14  1uF  [CAP_0402]
C15  1nF  [CAP_0402]
C16  1uF  [CAP_0402]
C17  1nF  [CAP_0402]
C18  100nF  [CAP_0402]
C19  100nF  [CAP_0402]
C20  1uF  [CAP_0402]
C22  2.2uF  [CAP_0402]
C23  100nF  [CAP_0402]
C24  2.2uF  [CAP_0402]
C25  2.2uF  [CAP_0402]
IC5  TPS22914BYFPR  [BGA4C40P2X2_75X75X50]
IC7  SGM4056-6.8YTDE8G_TR  [TDFN-8L_L2.0-W2.0-P0.50-BL-EP]
LED1  APG1005VBC-A1-5MAV  [APG1005VBCA15MAV]
Q1  DMN1260UFA-7B  [DMN1260UFA7B]
R3  10kΩ  [RES_0402]
R6  10kΩ  [RES_0402]
R9  1MΩ  [RES_0402]
R10  1MΩ  [RES_0402]
R11  1MΩ  [RES_0402]
R12  1MΩ  [RES_0402]
R13  1MΩ  [RES_0402]
R14  1MΩ  [RES_0402]
R15  10kΩ  [RES_0402]
R16  10kΩ  [RES_0402]
R17  10kΩ  [RES_0402]
SB1  SBO  [SB39X18]  (value not drawn)  (no BOM)
TP15  PAD  [TPPAD_1.0mm]  (value not drawn)  (no BOM)
TP16  PAD  [TPPAD_1.0mm]  (value not drawn)  (no BOM)
U2  NCP114AMX090TCG  [REG_NCP114AMX330TBG]
U3  NCP114AMX330TBG  [REG_NCP114AMX330TBG]
U5  NCP114AMX180TBG  [REG_NCP114AMX330TBG]
U7  TPS22976DPUR  [R-PWSON50P300x200-N14]

### Ports
LED_EN (in), VDD18EN_GP14 (in), VDDUSB0P9EN_GP15 (in), VDDUSB33EN_GP13 (in)

### Nets
GND: C1.2 C2.2 C3.2 C6.2 C7.2 C8.2 C9.2 C10.2 C11.2 C12.2 C13.2 C14.2 C15.2 C16.2 C17.2 C18.2 C19.2 C20.2 C22.2 C23.2 C24.2 C25.2 IC5.B1(GND) IC7.5(GND_1) IC7.9(GND_2) Q1.3(S) R3.1 R6.2 R10.1 R12.1 R14.1 R17.1 TP16.TP U2.2(GND) U2.5(EPAD) U3.2(GND) U3.5(EPAD) U5.2(GND) U5.5(EPAD) U7.11(GND) U7.PAD
VBAT: C8.1 C9.1 C10.1 C11.1 C22.1 C23.1 C24.1 IC7.8(BAT) SB1.2 TP15.TP U3.3(EN) U3.4(IN) U5.3(EN) U5.4(IN)
VBUS_5V: C20.1 C25.1 IC7.1(VIN) SB1.1 U7.4(VBIAS)
VDD18: C13.1 IC5.A1(VOUT)
VDD_0.9V: C1.1 C16.1 U2.1(OUT) U7.6(VIN2) U7.7(VIN2)
VDD_1.8V: C2.1 C12.1 IC5.A2(VIN) R9.2 R11.2 R13.2 U5.1(OUT)  [also labelled VDD_MCU, VDDAUDA, VDDB]
VDD_3.3V: C3.1 C6.1 C7.1 C14.1 R15.2 U2.3(EN) U2.4(IN) U3.1(OUT) U7.1(VIN1) U7.2(VIN1)
VDDUSB0P9: C18.1 U7.8(VOUT2) U7.9(VOUT2)
VDDUSB33: C19.1 U7.13(VOUT1) U7.14(VOUT1)
ADC3_I2S1CK_RTS1_GP16: R13.1 R14.2 U7.5(ON2) ; port VDDUSB0P9EN_GP15
ADC5_RX1_I2S0DIN_GP14: IC5.B2(ON) R11.1 R12.2 ; port VDD18EN_GP14
ADC6_I2S0WS_TX23_GP13: R9.1 R10.2 U7.3(ON1) ; port VDDUSB33EN_GP13
VCO_GP91: R16.2 ; port LED_EN
NetC15_1: C15.1 U7.12(CT1)
NetC17_1: C17.1 U7.10(CT2)
NetIC7_6: IC7.6(IMIN) R3.2
NetIC7_7: IC7.7(IREF) R6.1
NetLED1_1: LED1.1(K) Q1.1(D)
NetLED1_2: LED1.2(A) R15.1
NetQ1_2: Q1.2(G) R16.1 R17.2

Not connected (* = marked no-connect by the designer): IC7 2(~{PPR}) 3(~{CHG}) 4(~{EN})

### Notes on the sheet
- 1.8V Regulator
- 3.3V Regulator
- 0.9V USB Supply
- USB Sequencing
- MIPI Sequencing
- Battery Charging circuit
- LED GPIO Solder-Bridges
- (in symbol TitleBlock) Revision; Title; Sheet Name; Sheet; of; Date; Drawn By; Number; Aprvd By

### Library data of the parts
?#3 = TitleBlock: as ?#1 on sheet P01_Top Level; AMBIQ PN: TitleBlock
C1 C3 C22 C24 C25 = Capacitor: NONE; Manufacturer: Samsung; AMBIQ PN: CL05A225KP5NNNC; Tolerance: 10%; Voltage Rating: 10V; Supplier 1: Arrow Electronics; Supplier Part Number 1: CL05A225KP5NNNC; Manufacturer Part Number: CL05A225KP5NNNC; RoHS: Yes; Category: Ceramic Capacitors; Stock 1: 32414; Pricing 1: 1=0.14620, 10=0.09980, 25=0.09880, 100=0.05200, 250=0.05150, 500=0.03630, 1000=0.02990, 3000=0.02760, 6000=0.02610, 15000=0.023; Mount: Surface Mount; Case/Package: 0402; Case Code (Metric): 1005; Case Code (Imperial): 0402; Min Operating Temperature: -55°C; Max Operating Temperature: 85°C; Capacitance: 2.2uF; Packaging: Tape and Reel; Voltage Rating (DC): 10V; Series: CL; Length: 0.039inch; Width: 0.02inch; Thickness: 0.022inch; RoHS Compliant: Yes; ComponentLink1URL: https://datasheet.ciiva.com/25727/cl05a225kp5nnnc-25727777.pdf?src-supplier=Digi-Key; ComponentLink1Description: https://datasheet.ciiva.com/25727/cl05a225kp5nnnc-25727777.pdf?src-supplier=Digi-Key; Package Quantity: 1
C2 = CL05A225KP5NNNC: NONE; Manufacturer: Samsung; Tolerance: 10%; Voltage Rating: 10V; AMBIQ PN: CL05A225KP5NNNC; Supplier 1: Arrow Electronics; Supplier Part Number 1: CL05A225KP5NNNC; Manufacturer Part Number: CL05A225KP5NNNC; RoHS: Yes; Category: Ceramic Capacitors; Stock 1: 32414; Pricing 1: 1=0.14620, 10=0.09980, 25=0.09880, 100=0.05200, 250=0.05150, 500=0.03630, 1000=0.02990, 3000=0.02760, 6000=0.02610, 15000=0.023; Mount: Surface Mount; Case/Package: 0402; Case Code (Metric): 1005; Case Code (Imperial): 0402; Min Operating Temperature: -55°C; Max Operating Temperature: 85°C; Capacitance: 2.2uF; Packaging: Tape and Reel; Voltage Rating (DC): 10V; Series: CL; Length: 0.039inch; Width: 0.02inch; Thickness: 0.022inch; RoHS Compliant: Yes; ComponentLink1URL: https://datasheet.ciiva.com/25727/cl05a225kp5nnnc-25727777.pdf?src-supplier=Digi-Key; ComponentLink1Description: https://datasheet.ciiva.com/25727/cl05a225kp5nnnc-25727777.pdf?src-supplier=Digi-Key; Package Quantity: 1
C6 C10 C14 C16 C20 = Capacitor: NONE; Manufacturer: Samsung; Manufacturer Part Number: CL05A105MP5NNNC; AMBIQ PN: CL05A105KP5NNNC; Tolerance: 20%; Voltage Rating: 10V; Dielectric: X5R; Supplier 1: Newark; Supplier Part Number 1: 82AC9184; RoHS: Yes; Category: Ceramic Capacitors; Mount: Surface Mount; Case/Package: 0402; Case Code (Metric): 1005; Case Code (Imperial): 0402; Min Operating Temperature: -55°C; Max Operating Temperature: 85°C; Capacitance: 1uF; Packaging: Tape and Reel; Voltage Rating (DC): 10V; Series: CL; Construction: Flat; Length: 1mm; Width: 0.02inch; Height: 0.5mm; Thickness: 0.022inch; Depth: 0.5mm; Radiation Hardening: No; Lead Free: Lead Free; RoHS Compliant: Yes; ComponentLink1URL: https://datasheet.ciiva.com/25802/cl05a105mp5nnnc-25802049.pdf?src-supplier=Digi-Key; ComponentLink1Description: https://datasheet.ciiva.com/25802/cl05a105mp5nnnc-25802049.pdf?src-supplier=Digi-Key; Package Quantity: 1
C7 C9 C11 C18 C19 C23 = Capacitor: NONE; Manufacturer: Kyocera AVX; AMBIQ PN: 0201ZD104KAT2A; Tolerance: 10%; Voltage Rating: 10V; Supplier 1: Arrow Electronics; Supplier Part Number 1: 0201ZD104KAT2A; Manufacturer Part Number: 0201ZD104KAT2A; RoHS: Yes; Category: Ceramic Capacitors; Stock 1: 105000; Pricing 1: 15000=0.00770, 30000=0.00750, 45000=0.00740, 60000=0.00720, 75000=0.00690, 150000=0.00620 (USD); Mount: Surface Mount; Case/Package: 0201; Case Code (Metric): 0603; Case Code (Imperial): 0201; Min Operating Temperature: -55°C; Max Operating Temperature: 85°C; Capacitance: 100nF; Packaging: Tape and Reel; Voltage Rating (DC): 10V; Series: -; Lead Free: Lead Free; RoHS Compliant: Yes; ComponentLink1URL: http://www.mouser.com/ds/2/40/cx5r-776519.pdf?src-supplier=Mouser; ComponentLink1Description: http://www.mouser.com/ds/2/40/cx5r-776519.pdf?src-supplier=Mouser
C8 = CL05A105KP5NNNC: NONE; Manufacturer: Samsung; Manufacturer Part Number: CL05A105MP5NNNC; Tolerance: 20%; Voltage Rating: 10V; Dielectric: X5R; AMBIQ PN: CL05A105KP5NNNC; Supplier 1: Newark; Supplier Part Number 1: 82AC9184; RoHS: Yes; Category: Ceramic Capacitors; Mount: Surface Mount; Case/Package: 0402; Case Code (Metric): 1005; Case Code (Imperial): 0402; Min Operating Temperature: -55°C; Max Operating Temperature: 85°C; Capacitance: 1uF; Packaging: Tape and Reel; Voltage Rating (DC): 10V; Series: CL; Construction: Flat; Length: 1mm; Width: 0.02inch; Height: 0.5mm; Thickness: 0.022inch; Depth: 0.5mm; Radiation Hardening: No; Lead Free: Lead Free; RoHS Compliant: Yes; ComponentLink1URL: https://datasheet.ciiva.com/25802/cl05a105mp5nnnc-25802049.pdf?src-supplier=Digi-Key; ComponentLink1Description: https://datasheet.ciiva.com/25802/cl05a105mp5nnnc-25802049.pdf?src-supplier=Digi-Key; Package Quantity: 1
C12 C13 = Capacitor: NONE; Manufacturer: Murata; AMBIQ PN: GRM033R61A105ME15D; Tolerance: 20%; Voltage Rating: 10V; Dielectric: X5R; Supplier 1: Arrow Electronics; Supplier Part Number 1: GRM033R61A105ME15D; Manufacturer Part Number: GRM033R61A105ME15D; RoHS: Yes; Category: Ceramic Capacitors; Stock 1: 387591; Pricing 1: 1=0.35440, 10=0.26860, 25=0.26600, 50=0.24050, 100=0.18220, 250=0.18020, 500=0.17800, 1000=0.12040, 3000=0.11920, 6000=0.08160,; Mount: Surface Mount; Case/Package: 0201; Case Code (Metric): 0603; Case Code (Imperial): 0201; Min Operating Temperature: -55°C; Max Operating Temperature: 85°C; Capacitance: 1uF; Packaging: Tape and Reel; Voltage Rating (DC): 10V; Length: 0.024inch; Width: 0.012inch; Thickness: 0.015inch; RoHS Compliant: Yes; ComponentLink1URL: http://search.murata.co.jp/Ceramy/image/img/A01X/G101/ENG/GRM033R61A105ME15-01.pdf?src-supplier=Digi-Key; ComponentLink1Description: http://search.murata.co.jp/Ceramy/image/img/A01X/G101/ENG/GRM033R61A105ME15-01.pdf?src-supplier=Digi-Key
C15 C17 = Capacitor: NONE; Manufacturer: Murata; AMBIQ PN: GRM1555C1H102JA01D; Tolerance: 5%; Voltage Rating: 50V; Dielectric: C0G; Dielectric Material: Ceramic; Insulation Resistance: 10GR; Temperature Coefficient: 30ppm/°C; Supplier 1: Arrow Electronics; Supplier Part Number 1: GRM1555C1H102JA01D; Manufacturer Part Number: GRM1555C1H102JA01D; RoHS: Yes; Category: Ceramic Capacitors; Stock 1: 3380000; Pricing 1: 10000=0.00710, 20000=0.00680, 30000=0.00660, 50000=0.00590, 100000=0.00470 (USD); Mount: Surface Mount; Case/Package: 0402; Case Code (Metric): 1005; Case Code (Imperial): 0402; Min Operating Temperature: -55°C; Max Operating Temperature: 125°C; Capacitance: 1nF; Packaging: Tape and Reel; Voltage: 50V; Voltage Rating (DC): 50V; Series: GRM; Construction: Flat; Length: 1mm; Width: 0.5mm; Height: 0.5mm; Thickness: 0.022inch; Depth: 0.5mm; Radiation Hardening: No; REACH SVHC: No SVHC; Lead Free: Lead Free; RoHS Compliant: Yes; ComponentLink1URL: https://datasheet.ciiva.com/34302/1855908-34302849.pdf?src-supplier=Jameco; ComponentLink1Description: https://datasheet.ciiva.com/34302/1855908-34302849.pdf?src-supplier=Jameco; Package Quantity: 1; Termination: SMD/SMT; Number of Pins: 2; Material: Ceramic; Size: 0.5mm
IC5 = TPS22914BYFPR: Integrated Circuit; Manufacturer_Name: Texas Instruments; Datasheet Link: http://www.ti.com/lit/gpn/tps22914; Height: 0.5mm; Manufacturer_Part_Number: TPS22914BYFPR; Mouser Part Number: 595-TPS22914BYFPR; Mouser Price/Stock: https://www.mouser.co.uk/ProductDetail/Texas-Instruments/TPS22914BYFPR?qs=1MXlzafEN3%2Fs%2F8ixf9s9cA%3D%3D; Arrow Part Number: TPS22914BYFPR; Arrow Price/Stock: https://www.arrow.com/en/products/tps22914byfpr/texas-instruments?region=nac
IC7 = SGM4056-6.8YTDE8G_TR: Integrated Circuit; Manufacturer_Name: SGMICRO; Manufacturer_Part_Number: SGM4056-10.5YTDE8G/TR; Datasheet Link: https://4donline.ihs.com/images/VipMasterIC/IC/SGML/SGML-S-A0002247971/SGML-S-A0002247971-1.pdf?hkey=EF798316E3902B6ED9A73243A3159BB0; Height: 0.8mm
LED1 = APG1005VBC-A1-5MAV: LED; Manufacturer_Name: Kingbright; Datasheet Link: https://www.kingbrightusa.com/images/catalog/SPEC/APG1005VBC-A1-5MAV.pdf; Height: 0.25mm; Manufacturer_Part_Number: APG1005VBC-A1-5MAV; Mouser Part Number: 604-APG1005VBCA15MAV; Mouser Price/Stock: https://www.mouser.co.uk/ProductDetail/Kingbright/APG1005VBC-A1-5MAV?qs=Wj%2FVkw3K%252BMBzMdKeIeaEww%3D%3D
Q1 = DMN1260UFA-7B: MOSFET (N-Channel); Manufacturer_Name: Diodes Incorporated; Datasheet Link: https://www.diodes.com/assets/Datasheets/DMN1260UFA.pdf; Height: 0.4mm; Manufacturer_Part_Number: DMN1260UFA-7B; Mouser Part Number: 621-DMN1260UFA-7B; Mouser Price/Stock: https://www.mouser.co.uk/ProductDetail/Diodes-Incorporated/DMN1260UFA-7B?qs=TL2rE588Q1GjQdkyrZCA4w%3D%3D; Arrow Part Number: DMN1260UFA-7B; Arrow Price/Stock: https://www.arrow.com/en/products/dmn1260ufa-7b/diodes-incorporated
R3 R6 R15-R17 = Resistor: Surface Mount Thick Film Resistor, Rc Series, 10 Kohm, 62.5 Mw, - 1%, 50 V, 0402 [1005 Metric]; Manufacturer: Yageo; AMBIQ PN: RC0402FR-0710KL; Resistance: 10kR; Power Rating: 62.5mW; Voltage Rating: 50V; Max Power Dissipation: 63mW; Temperature Coefficient: 100ppm/°C; Supplier 1: Arrow Electronics; Supplier Part Number 1: RC0402FR-0710KL; Manufacturer Part Number: RC0402FR-0710KL; RoHS: Yes; Category: Chip SMD Resistors; Stock 1: 7776428; Pricing 1: 10000=0.00210 (USD); Case/Package: 0402; Case Code (Metric): 1005; Case Code (Imperial): 0402; Min Operating Temperature: -55°C; Max Operating Temperature: 155°C; Packaging: Tape and Reel; Resistor Type: Thick Film; Number of Terminations: 2; Termination: SMD/SMT; Voltage Rating (DC): 50V; Features: Moisture Resistant; Series: RC; Construction: Rectangular; Length: 1mm; Width: 0.5mm; Height: 0.32mm; Depth: 0.5mm; REACH SVHC: No SVHC; Military Standard: Not; Lead Free: Lead Free; RoHS Compliant: Yes; ComponentLink1URL: https://datasheet.ciiva.com/7660/38568-7660787.pdf?src-supplier=Element14; ComponentLink1Description: https://datasheet.ciiva.com/7660/38568-7660787.pdf?src-supplier=Element14; ComponentLink2URL: https://datasheet.ciiva.com/7849/1686128-7849814.pdf?src-supplier=Element14; ComponentLink2Description: https://datasheet.ciiva.com/7849/1686128-7849814.pdf?src-supplier=Element14; ComponentLink3URL: https://datasheet.ciiva.com/7983/1018594-7983486.pdf?src-supplier=Element14; Tolerance: 1%; Number of Pins: 2; Resistance Tolerance: 1%; Working Voltage: 50V; Lead Pitch: 0.2mm
R9-R14 = Resistor: RES SMD 1M OHM 1% 1/10W 0402; Manufacturer: Panasonic; AMBIQ PN: ERJ-2RKF1004X; Resistance: 1MR; Power Rating: 100mW; Voltage Rating: 50V; Temperature Coefficient: 100ppm/°C; Supplier 1: Arrow Electronics; Supplier Part Number 1: ERJ-2RKF1004X; Manufacturer Part Number: ERJ-2RKF1004X; RoHS: Yes; Category: Chip SMD Resistors; Stock 1: 330000; Pricing 1: 10000=0.00500, 30000=0.00450, 50000=0.00440, 100000=0.00400 (USD); Mount: Surface Mount; Case/Package: 0402; Weight: 2.8E-05oz; Case Code (Metric): 1005; Case Code (Imperial): 0402; Contact Plating: Tin; Min Operating Temperature: -55°C; Max Operating Temperature: 155°C; Package Quantity: 1; Packaging: Tape and Reel; Resistor Type: Thick Film; Number of Terminations: 2; Termination: SMD/SMT; Max Power Dissipation: 100mW; Voltage Rating (DC): 50V; Features: Automotive AEC-Q200; Series: ERJ; Technology: THICK FILM; Construction: Rectangular; Length: 1mm; Width: 0.02inch; Height: 0.35mm; Depth: 0.5mm; Radiation Hardening: No; REACH SVHC: Yes; Military Standard: Not; Lead Free: Lead Free; RoHS Compliant: Yes; ComponentLink1URL: https://datasheet.ciiva.com/34303/1987046-34303551.pdf; ComponentLink1Description: https://datasheet.ciiva.com/34303/1987046-34303551.pdf; ComponentLink2URL: https://datasheet.ciiva.com/11821/0900766b80f80784-11821229.pdf; ComponentLink2Description: https://datasheet.ciiva.com/11821/0900766b80f80784-11821229.pdf; ComponentLink3URL: https://datasheet.ciiva.com/7909/aoa0000ce2-7909180.pdf; Tolerance: 1%; Number of Pins: 2; Resistance Tolerance: 1%; Working Voltage: 50V
SB1 = SBO: None; AMBIQ PN: SBO
TP15 TP16 = TP_PAD: None; AMBIQ PN: TP_PAD
U2 = NCP114AMX090TCG: Linear Voltage Regulator IC Positive Fixed 1 Output 300mA 4-UDFN _1.0x1.0_; MP: NCP114AMX330TBG; MF: ON Semiconductor; Availability: Unavailable; Package: UDFN-4 ON Semiconductor; Value: *; Price: None; SnapEDA_Link: https://www.snapeda.com/parts/NCP114AMX330TBG/ON%20Semiconductor/view-part/711351/?ref=snap
U3 U5 = NCP114AMX330TBG: Linear Voltage Regulator IC Positive Fixed 1 Output 300mA 4-UDFN _1.0x1.0_; MF: ON Semiconductor; MP: NCP114AMX330TBG; Availability: Unavailable; Package: UDFN-4 ON Semiconductor; Value: *; Price: None; SnapEDA_Link: https://www.snapeda.com/parts/NCP114AMX330TBG/ON%20Semiconductor/view-part/711351/?ref=snap
U7 = TPS22976: None; Manufacturer: Texas Instruments; AMBIQ PN: TPS22976DPUT; Max Supply Voltage: 6V; Min Supply Voltage: 2.3V; Interface: On/Off; Output Type: Adjustable; Number of Outputs: 2; Max Output Current: 6A; Fault Protection: Over Temperature; Output Configuration: High Side; Output Current: 1A; Output Voltage: 5V; Quiescent Current: 220uA; Polarity: Positive; Accuracy: 0.5%; Dropout Voltage: 250mV; Input Bias Current: 120uA; Min Output Voltage: 800mV; Reference Voltage: 410mV; Manufacturer Part Number: TPS22976DPUT; Supplier 1: Arrow Electronics; Supplier Part Number 1: TPS22976DPUT; RoHS: Yes; Category: Power Management ICs; Stock 1: 250; Pricing 1: 1=0.70530, 10=0.67280, 25=0.64030, 100=0.60770, 250=0.57510 (USD); Number of Pins: 14; Min Operating Temperature: -40°C; Max Operating Temperature: 105°C; Package Quantity: 4000; Packaging: Tape and Reel; REACH SVHC: No SVHC; Lead Free: Lead Free; RoHS Compliant: Yes; ComponentLink1URL: http://www.ti.com/general/docs/suppproductinfo.tsp?distId=10&amp;gotoUrl=http%3A%2F%2Fwww.ti.com%2Flit%2Fgpn%2Ftps22976&src-sup; ComponentLink1Description: http://www.ti.com/general/docs/suppproductinfo.tsp?distId=10&amp;gotoUrl=http%3A%2F%2Fwww.ti.com%2Flit%2Fgpn%2Ftps22976&src-sup; ComponentLink2URL: https://datasheet.ciiva.com/41458/001085984-da-01-en-ic-reg-ld-mcp1826t-adje-dc-sot-223-5-mcp-41458757.pdf?src-supplier=Conrad; ComponentLink2Description: https://datasheet.ciiva.com/41458/001085984-da-01-en-ic-reg-ld-mcp1826t-adje-dc-sot-223-5-mcp-41458757.pdf?src-supplier=Conrad; Length: 0.257inch; Width: 0.14inch; Height: 0.065inch; Radiation Hardening: No; Number of Channels: 2; Max Input Voltage: 6V; Min Input Voltage: 2.3V; Output Voltage Accuracy: 0.5%; Max Output Voltage: 5V; Termination: SMD/SMT; Halogen Free: Halogen Free

## Sheet P04_ USB.SchDoc
size A4; SheetNumber: 4; SheetTotal: 7
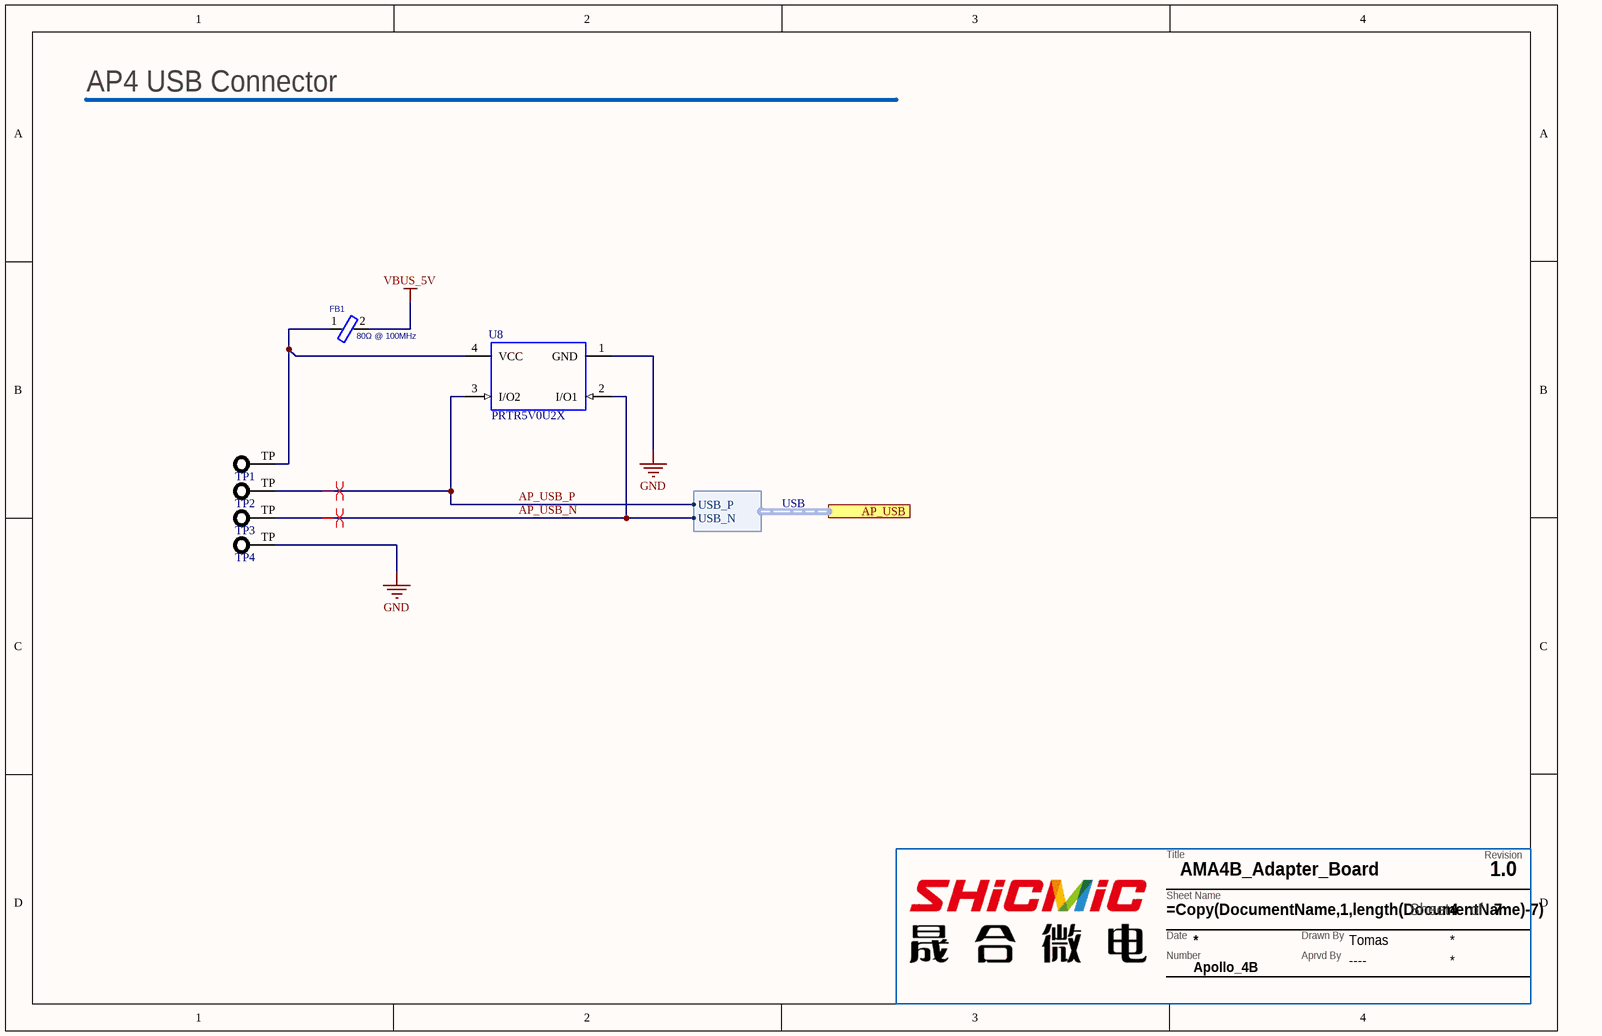
[diagram p4: P04_ USB.SchDoc]

### Parts
(Parts that share a designator on the sheet are numbered #1, #2 ... from top to bottom, then left to right.)
?#4  TitleBlock  (value not drawn)  (graphical)
FB1  80Ω @ 100MHz  [IPC_A]
TP1  PAD  [TPPAD_1.5mm]  (value not drawn)  (no BOM)
TP2  PAD  [TPPAD_1.5mm]  (value not drawn)  (no BOM)
TP3  PAD  [TPPAD_1.5mm]  (value not drawn)  (no BOM)
TP4  PAD  [TPPAD_1.5mm]  (value not drawn)  (no BOM)
U8  PRTR5V0U2X  [SOT143L]

### Ports
AP_USB (harness USB)

### Harnesses
USB: USB_N, USB_P

### Nets
GND: TP4.TP U8.1(GND)
VBUS_5V: FB1.2
AP_USB_N: TP3.TP U8.2(I/O1) ; port AP_USB.USB_N  [project net AP_USB.USB_N]
AP_USB_P: TP2.TP U8.3(I/O2) ; port AP_USB.USB_P  [project net AP_USB.USB_P]
NetFB1_1: FB1.1 TP1.TP U8.4(VCC)

### Layout directives
differential pair: AP_USB.USB_N, AP_USB.USB_P

### Notes on the sheet
- AP4 USB Connector
- (in symbol TitleBlock) Revision; Title; Sheet Name; Sheet; of; Date; Drawn By; Number; Aprvd By

### Library data of the parts
?#4 = TitleBlock: as ?#1 on sheet P01_Top Level; AMBIQ PN: TitleBlock
FB1 = Ferrite: NONE; Manufacturer: Taiyo Yuden; AMBIQ PN: FBMJ3216HS800-T; Impedance: 80R; Tolerance: 25%; DC Resistance (DCR): 10mR; Max DC Current: 4A; Number of Lines: 1; Shielding: Unshielded; Supplier 1: Newark; Supplier Part Number 1: 86H5353; Manufacturer Part Number: FBMJ3216HS800-T; RoHS: Yes; Category: Ferrite Beads and Chips; Stock 1: 265; Pricing 1: 1=0.30000, 10=0.20700, 25=0.17700, 50=0.14800, 100=0.11800 (USD); ComponentLink1URL: https://datasheet.ciiva.com/5709/chipbeads01-e-5709344.pdf?src-supplier=Farnell; ComponentLink1Description: https://datasheet.ciiva.com/5709/chipbeads01-e-5709344.pdf?src-supplier=Farnell; Mount: Surface Mount; Case/Package: 1206; Number of Pins: 2; Core Material: Ferrite; Case Code (Metric): 3216; Case Code (Imperial): 1206; Material: Ferrite; Min Operating Temperature: -40°C; Max Operating Temperature: 125°C; Packaging: Tape and Reel; Resistance: 10mR; Package Quantity: 1; Max Current Rating: 4A; Termination: SMD/SMT; Test Frequency: 100MHz; Frequency: 100MHz; Series: FB; Resistor Type: Ferrite Bead; Length: 3.2mm; Width: 0.063inch; Height: 1.3mm; Depth: 1.8mm; Lead Free: Lead Free; Halogen Free: Halogen Free; REACH SVHC: No SVHC; ComponentLink2URL: https://datasheet.ciiva.com/16001/202fbmj3216hs800-t-16001070.pdf?src-supplier=Onlinecomponents.com; ComponentLink2Description: https://datasheet.ciiva.com/16001/202fbmj3216hs800-t-16001070.pdf?src-supplier=Onlinecomponents.com; ComponentLink3URL: https://datasheet.ciiva.com/30088/23fbmj3216hs800-t-30088710.pdf?src-supplier=Onlinecomponents.com; ComponentLink3Description: https://datasheet.ciiva.com/30088/23fbmj3216hs800-t-30088710.pdf?src-supplier=Onlinecomponents.com; ComponentLink4URL: https://datasheet.ciiva.com/23606/fbmj3216hs800-t-ss-23606768.pdf?src-supplier=Newark; ComponentLink4Description: https://datasheet.ciiva.com/23606/fbmj3216hs800-t-ss-23606768.pdf?src-supplier=Newark; ComponentLink5URL: https://datasheet.ciiva.com/25614/0900766b810b37be-25614395.pdf?src-supplier=RSComponents; ComponentLink5Description: https://datasheet.ciiva.com/25614/0900766b810b37be-25614395.pdf?src-supplier=RSComponents; ComponentLink6URL: https://datasheet.ciiva.com/6212/chipbeads01-e-6212909.pdf?src-supplier=Digi-Key; ComponentLink6Description: https://datasheet.ciiva.com/6212/chipbeads01-e-6212909.pdf?src-supplier=Digi-Key; ComponentLink7URL: https://datasheet.ciiva.com/7966/chipbeads01-e-7966171.pdf?src-supplier=Element14; ComponentLink7Description: https://datasheet.ciiva.com/7966/chipbeads01-e-7966171.pdf?src-supplier=Element14
TP1-TP4 = TP_PAD: None; AMBIQ PN: TP_PAD
U8 = PRTR5V0U2X: None; Manufacturer: Nexperia; AMBIQ PN: PRTR5V0U2X,215; Manufacturer Part Number: PRTR5V0U2X,215; Supplier 1: Arrow Electronics; Supplier Part Number 1: PRTR5V0U2X,215; RoHS: Yes; Category: ESD and Circuit Protection ICs; Stock 1: 234000; Pricing 1: 3000=0.18050, 6000=0.16890, 15000=0.15880 (USD); RoHS Compliant: Yes; ComponentLink1URL: http://www.farnell.com/datasheets/109718.pdf?src-supplier=Farnell; ComponentLink1Description: http://www.farnell.com/datasheets/109718.pdf?src-supplier=Farnell; ComponentLink2URL: https://assets.nexperia.com/documents/data-sheet/PRTR5V0U2X.pdf?src-supplier=Digi-Key; ComponentLink2Description: https://assets.nexperia.com/documents/data-sheet/PRTR5V0U2X.pdf?src-supplier=Digi-Key

## Sheet P05_ Debugger.SchDoc
size A4; SheetNumber: 5; SheetTotal: 7
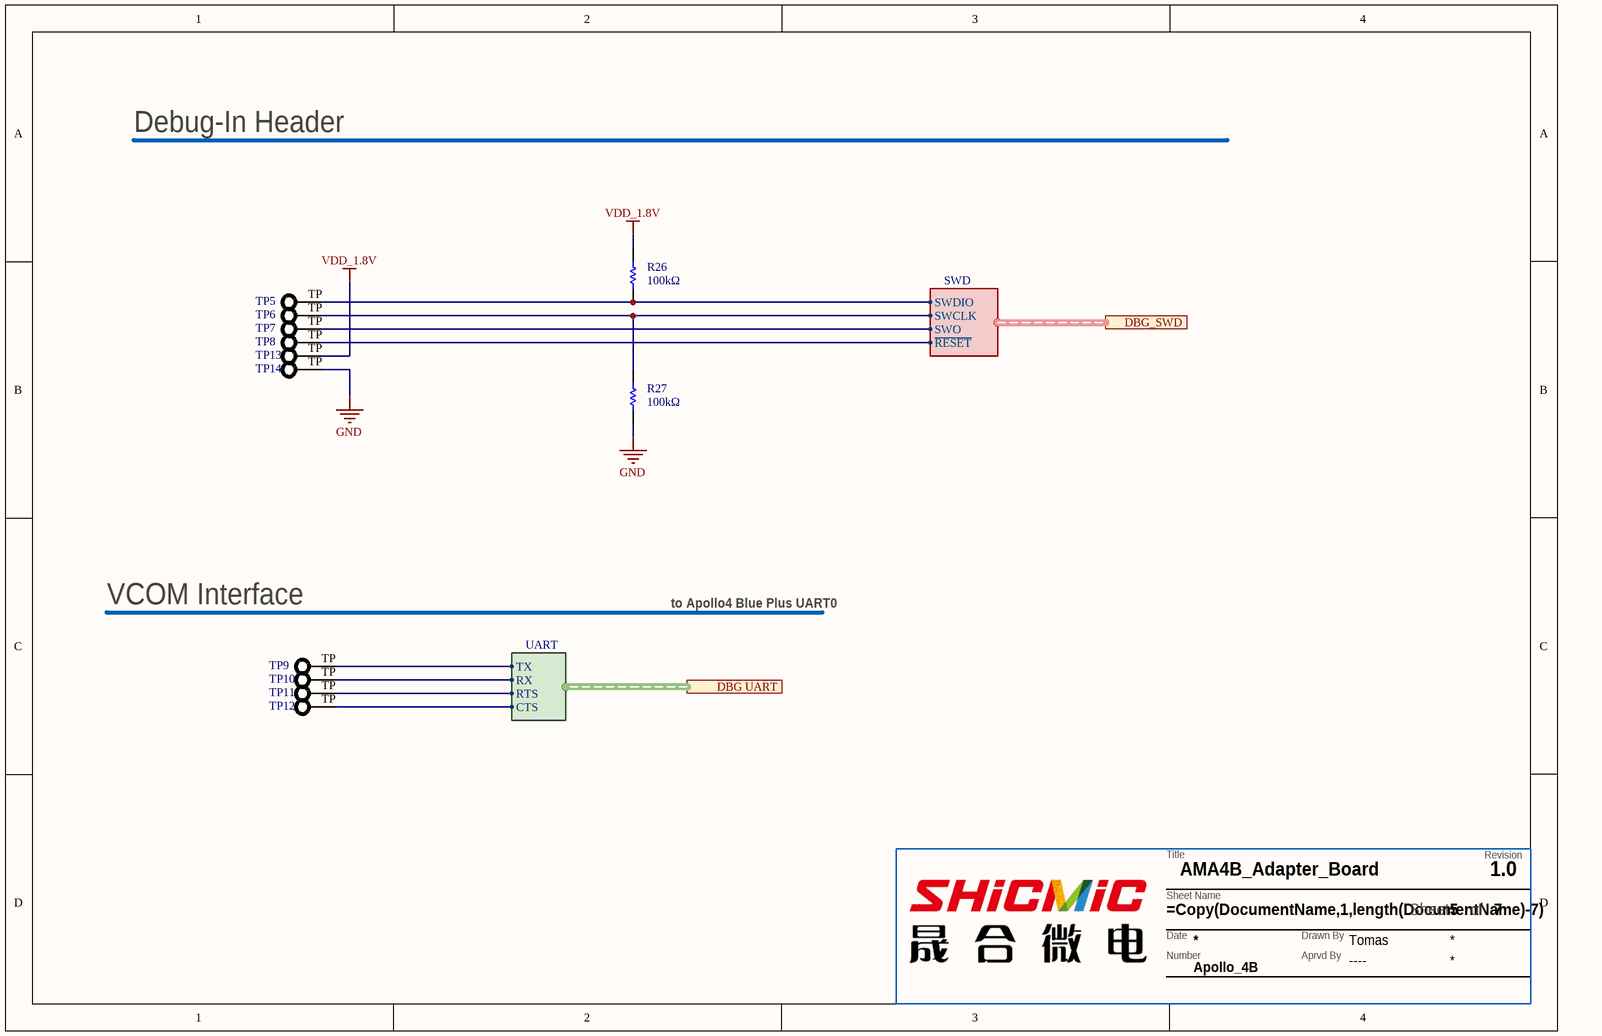
[diagram p5: P05_ Debugger.SchDoc]

### Parts
(Parts that share a designator on the sheet are numbered #1, #2 ... from top to bottom, then left to right.)
??#1  TitleBlock  (value not drawn)  (graphical)
R26  100kΩ  [RES_0402]
R27  100kΩ  [RES_0402]
TP5  PAD  [TPPAD_1.0mm]  (value not drawn)  (no BOM)
TP6  PAD  [TPPAD_1.0mm]  (value not drawn)  (no BOM)
TP7  PAD  [TPPAD_1.0mm]  (value not drawn)  (no BOM)
TP8  PAD  [TPPAD_1.0mm]  (value not drawn)  (no BOM)
TP9  PAD  [TPPAD_1.0mm]  (value not drawn)  (no BOM)
TP10  PAD  [TPPAD_1.0mm]  (value not drawn)  (no BOM)
TP11  PAD  [TPPAD_1.0mm]  (value not drawn)  (no BOM)
TP12  PAD  [TPPAD_1.0mm]  (value not drawn)  (no BOM)
TP13  PAD  [TPPAD_1.0mm]  (value not drawn)  (no BOM)
TP14  PAD  [TPPAD_1.0mm]  (value not drawn)  (no BOM)

### Ports
DBG UART (harness UART), DBG_SWD (harness SWD)

### Harnesses
UART: TX, RX, RTS, CTS
SWD: SWCLK, SWDIO, SWO, ~{RESET}

### Nets
GND: R27.1 TP14.TP
VDD_1.8V: R26.2 TP13.TP
ADC7_I2S0DAT_TX01_CMRF2_I2S0DOUT_GP12: TP10.TP ; port DBG UART.RX
M5MISO_I2S1WS_RTS01_GP49: TP12.TP ; port DBG UART.CTS
M5SCL_M5SCK_I2S1CK_RX01_GP47: TP9.TP ; port DBG UART.TX
nRST: TP8.TP ; port DBG_SWD.~{RESET}
SWDCK_TX01_GP20: R27.2 TP6.TP ; port DBG_SWD.SWCLK
SWDIO_TX23_GP21: R26.1 TP5.TP ; port DBG_SWD.SWDIO
SWO_VCO_IS20CK_DSPTDO_GP28: TP7.TP ; port DBG_SWD.SWO

Not connected (* = marked no-connect by the designer): TP11 TP

### Notes on the sheet
- Debug-In Header
- VCOM Interface
- to Apollo4 Blue Plus UART0
- (in symbol TitleBlock) Revision; Title; Sheet Name; Sheet; of; Date; Drawn By; Number; Aprvd By

### Library data of the parts
??#1 = TitleBlock: as ?#1 on sheet P01_Top Level; AMBIQ PN: TitleBlock
R26 R27 = Resistor: RES SMD 100K OHM 1% 1/10W 0402; Manufacturer: Panasonic; AMBIQ PN: ERJ-2RKF1003X; Resistance: 100kR; Power Rating: 100mW; Voltage Rating: 50V; Temperature Coefficient: 100ppm/°C; Supplier 1: Arrow Electronics; Supplier Part Number 1: ERJ-2RKF1003X; Manufacturer Part Number: ERJ-2RKF1003X; RoHS: Yes; Category: Chip SMD Resistors; Stock 1: 267708; Pricing 1: 10000=0.00840 (USD); Mount: Surface Mount; Case/Package: 0402; Weight: 0.000388oz; Case Code (Metric): 1005; Case Code (Imperial): 0402; Contact Plating: Tin; Min Operating Temperature: -55°C; Max Operating Temperature: 155°C; Package Quantity: 10000; Packaging: Cut Tape; Resistor Type: Thick Film; Number of Terminations: 2; Termination: SMD/SMT; Max Power Dissipation: 100mW; Voltage Rating (DC): 50V; Features: Automotive AEC-Q200; Series: ERJ-2Rx; Technology: THICK FILM; Length: 1mm; Width: 0.5mm; Height: 0.35mm; Depth: 0.5mm; Radiation Hardening: No; REACH SVHC: No SVHC; Military Standard: Not; Lead Free: Lead Free; RoHS Compliant: Yes; ComponentLink1URL: https://datasheet.ciiva.com/34303/1987038-34303550.pdf?src-supplier=Jameco; ComponentLink1Description: https://datasheet.ciiva.com/34303/1987038-34303550.pdf?src-supplier=Jameco; ComponentLink2URL: https://datasheet.ciiva.com/11821/0900766b80f80784-11821175.pdf?src-supplier=RSComponents; ComponentLink2Description: https://datasheet.ciiva.com/11821/0900766b80f80784-11821175.pdf?src-supplier=RSComponents; ComponentLink3URL: https://datasheet.ciiva.com/7830/aoa0000ce2-7830725.pdf?src-supplier=Element14; Tolerance: 1%; Number of Pins: 2
TP5-TP14 = TP_PAD: None; AMBIQ PN: TP_PAD